# EAGLE design power_control_v12 (EAGLE 9.6.2)
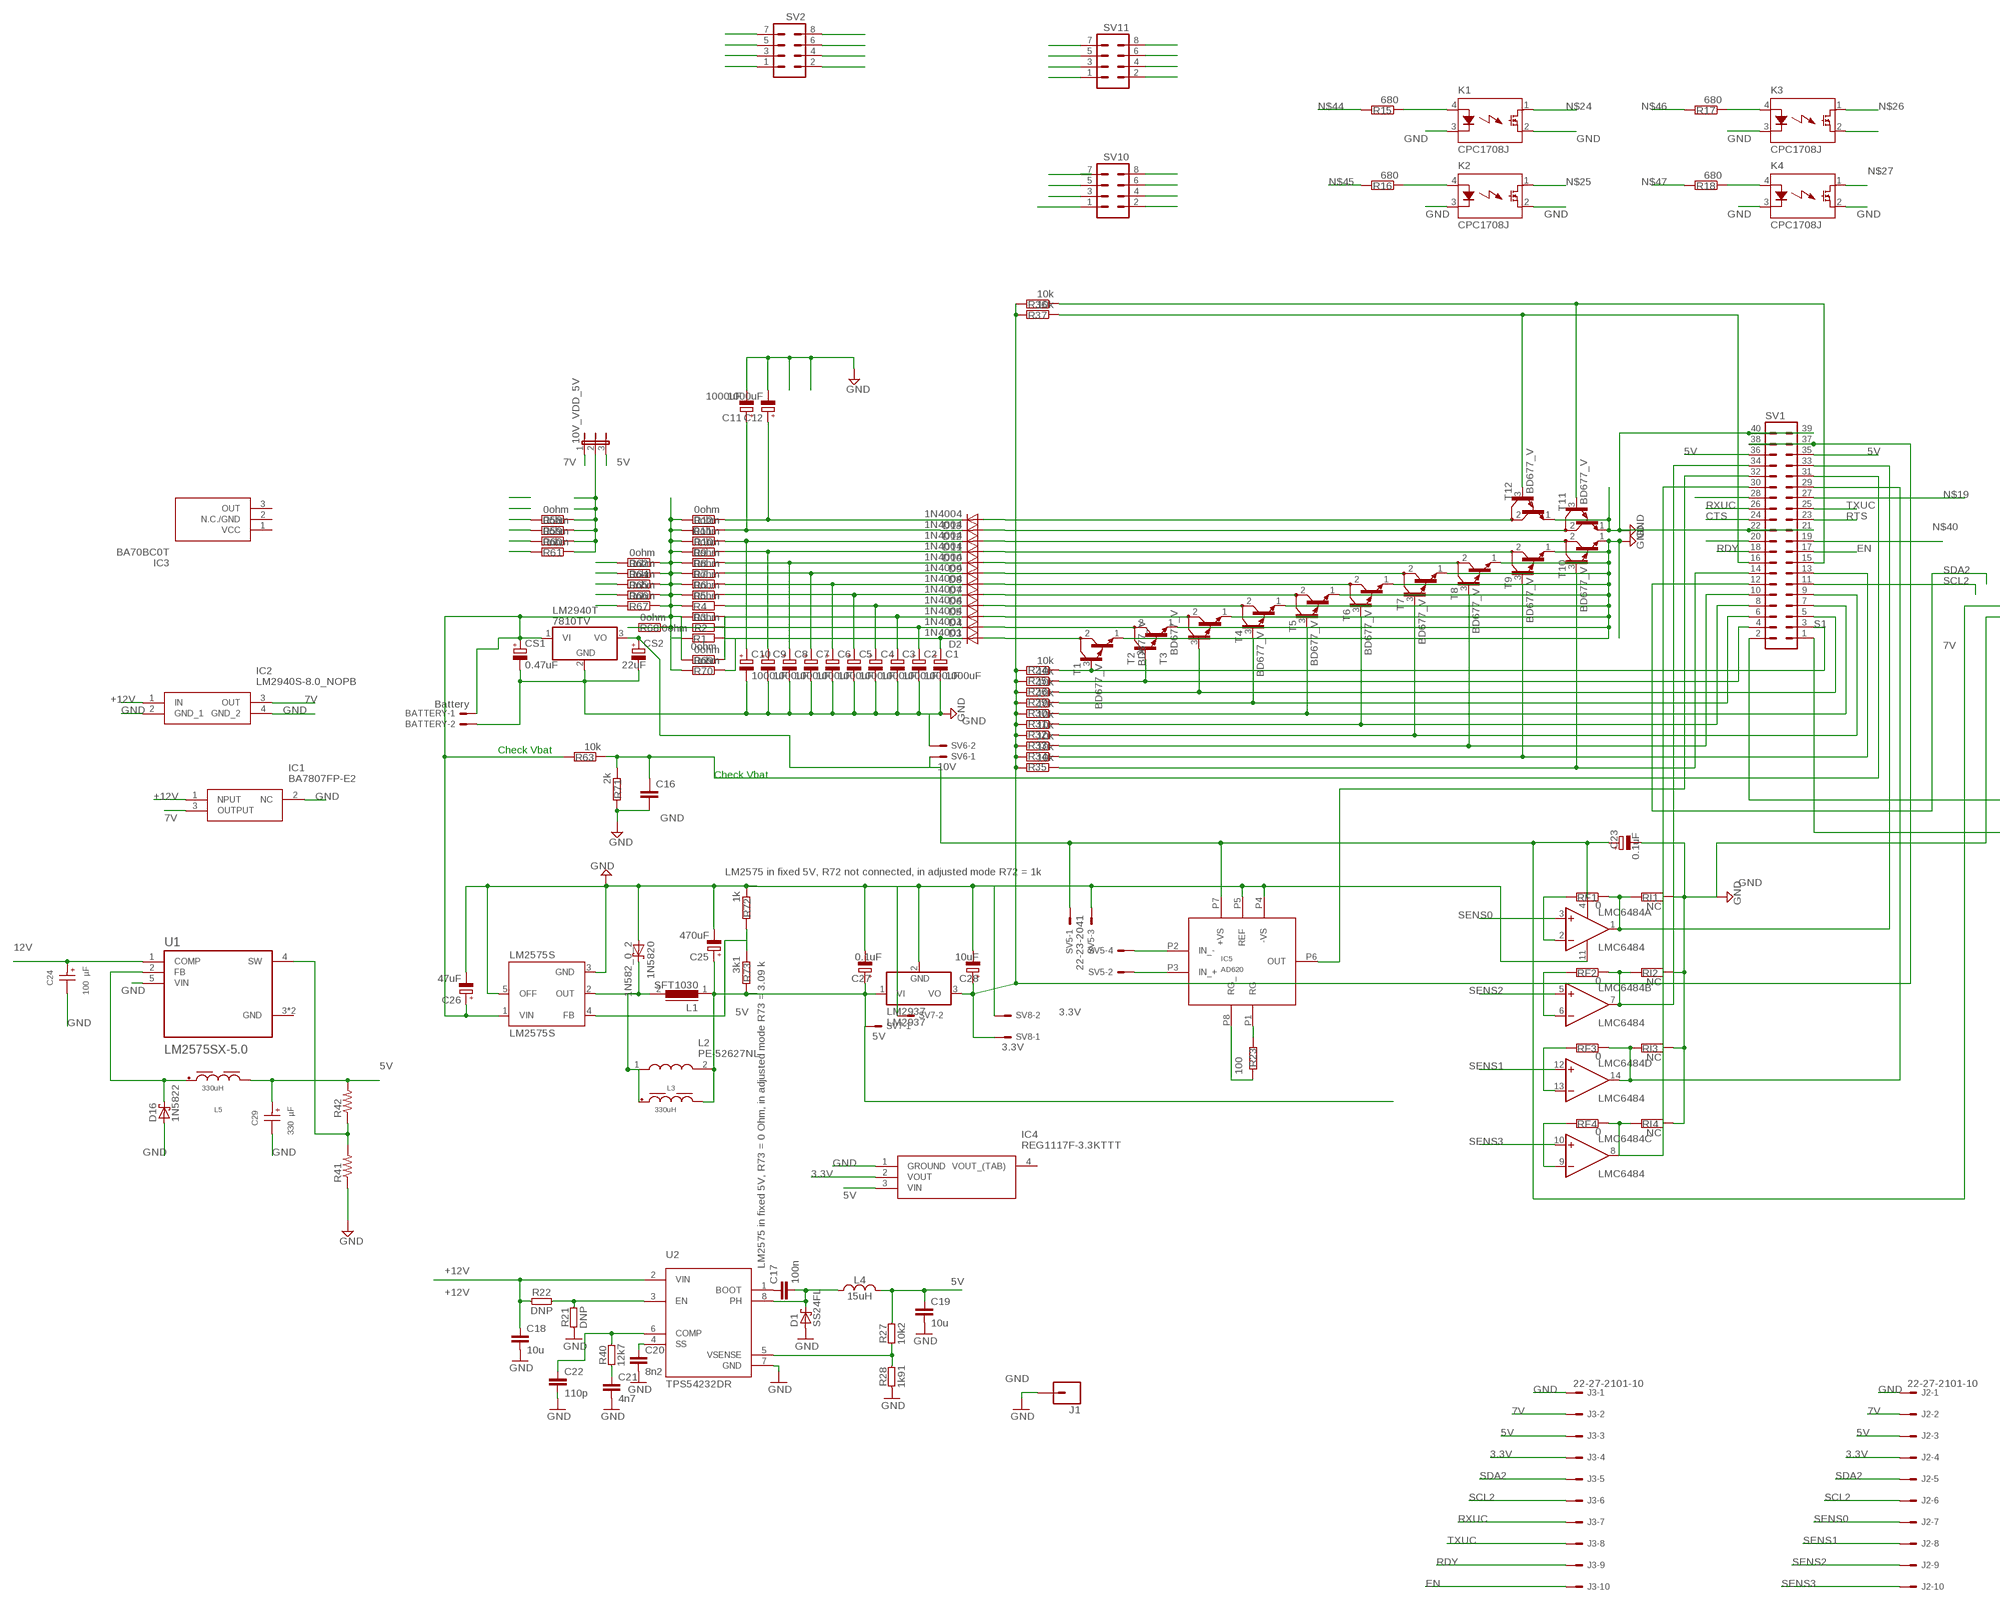
[diagram p0: schematic, sheet 1, part 1 of 2]
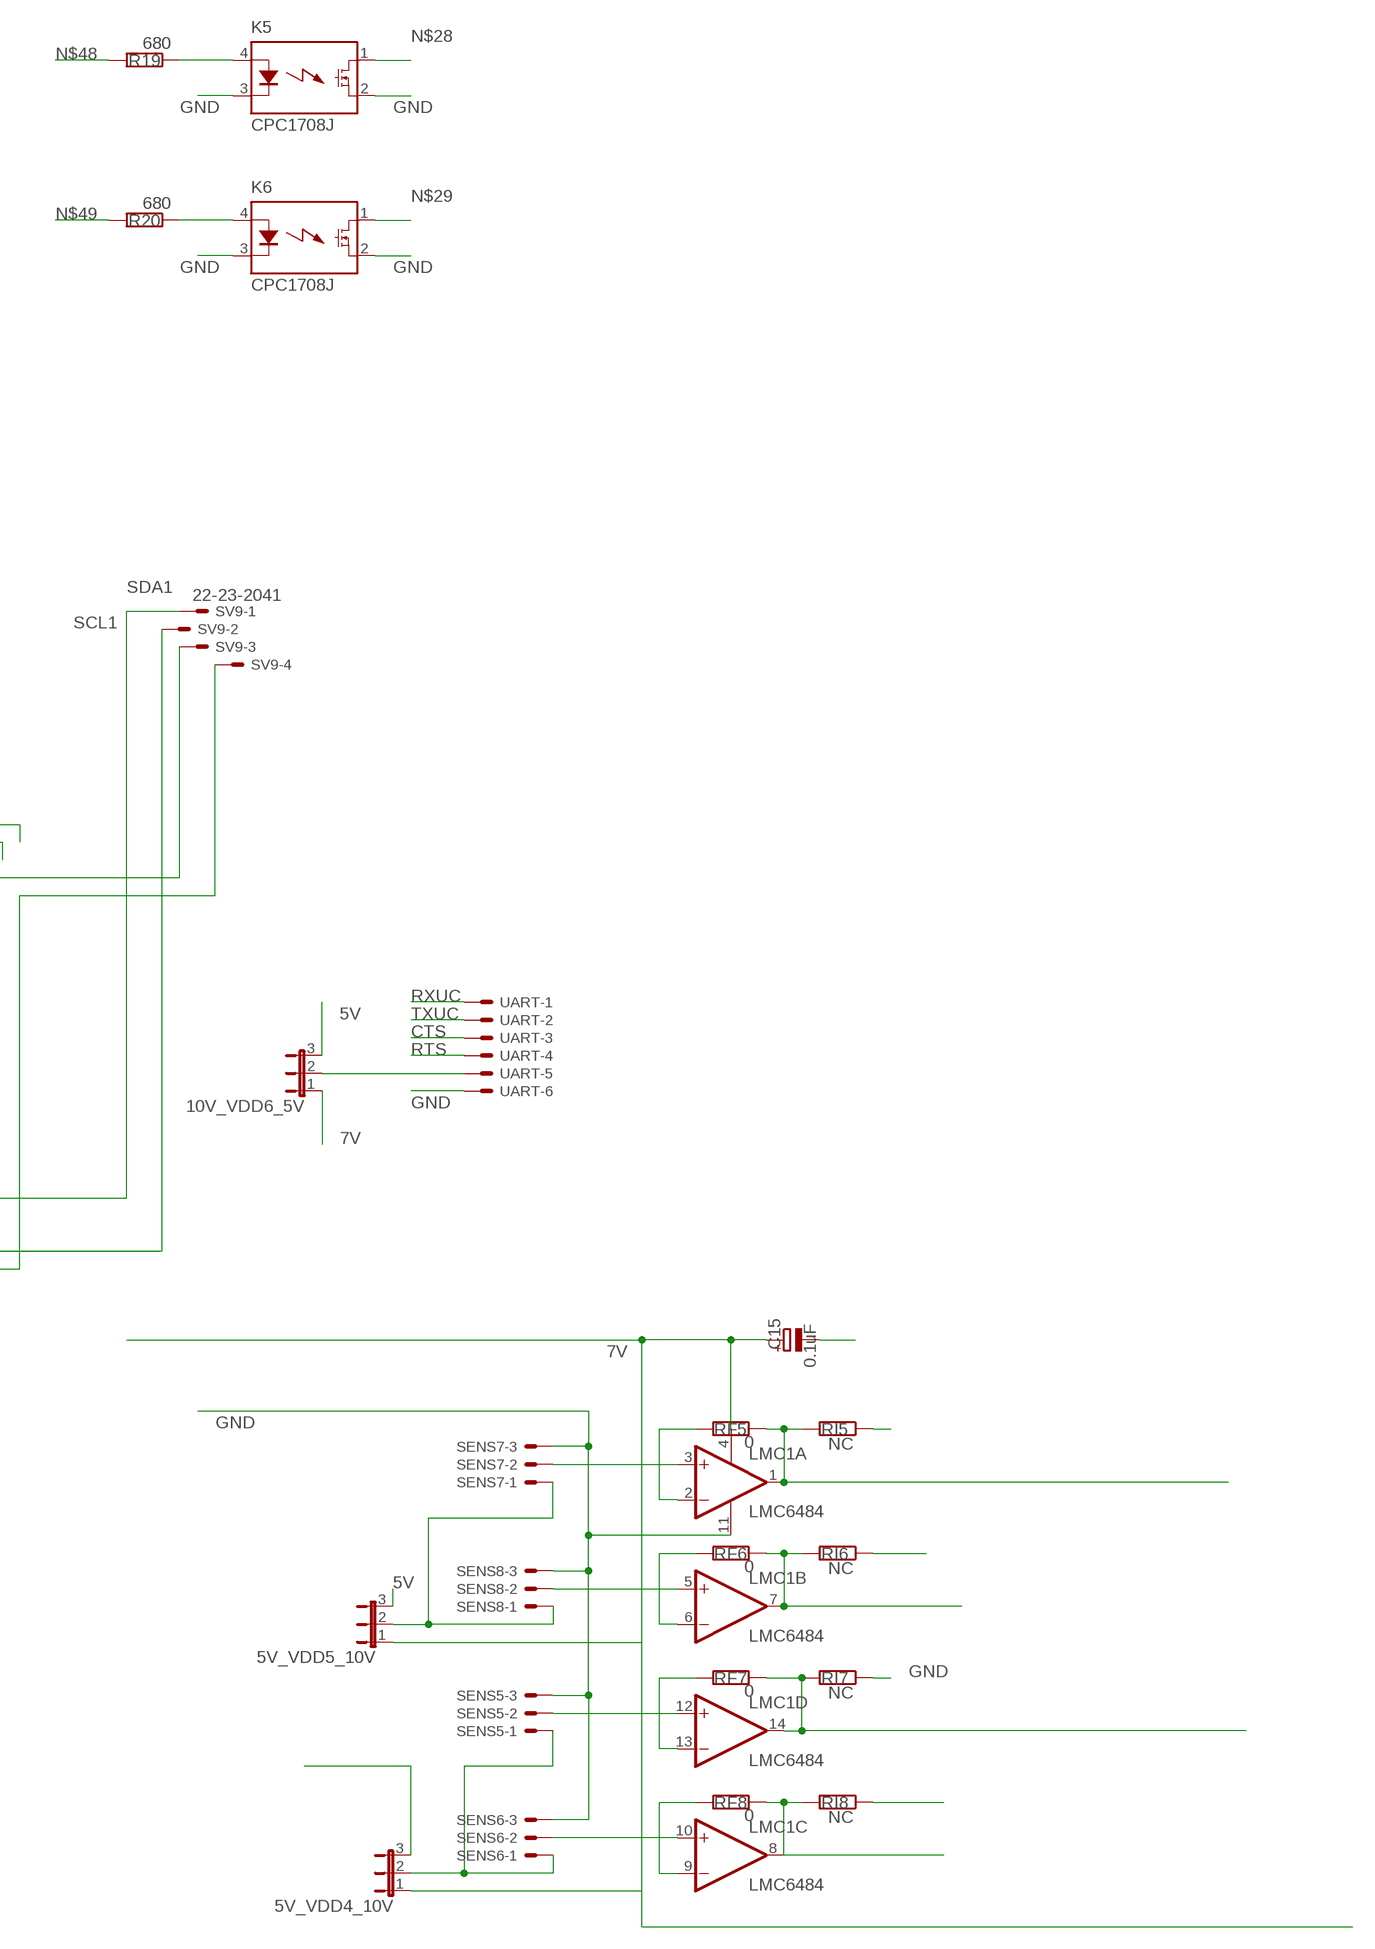
[diagram p1: schematic, sheet 1, part 2 of 2]

## Parts
1N5820  1N582_0_2  SCHOTTKY-DIODEC4111-15  [C4111-15]
5V_VDD4_10V  JP2E  [JP2]
5V_VDD5_10V  JP2E  [JP2]
10V_VDD6_5V  JP2E  [JP2]
10V_VDD_5V  JP2E  [JP2]
BATTERY  Battery  22-23-2021  [22-23-2021]
C1  1000uF  CPOL-EUE5-10.5  [E5-10,5]
C2  1000uF  CPOL-EUE5-10.5  [E5-10,5]
C3  1000uF  CPOL-EUE5-10.5  [E5-10,5]
C4  1000uF  CPOL-EUE5-10.5  [E5-10,5]
C5  1000uF  CPOL-EUE5-10.5  [E5-10,5]
C6  1000uF  CPOL-EUE5-10.5  [E5-10,5]
C7  1000uF  CPOL-EUE5-10.5  [E5-10,5]
C8  1000uF  CPOL-EUE5-10.5  [E5-10,5]
C9  1000uF  CPOL-EUE5-10.5  [E5-10,5]
C10  1000uF  CPOL-EUE5-10.5  [E5-10,5]
C11  1000uF  CPOL-EUE5-10.5  [E5-10,5]
C12  1000uF  CPOL-EUE5-10.5  [E5-10,5]
C15  0.1uF  CPOL-EUE1.8-4  [E1,8-4]
C16  C-EUC0805K  [C0805K]
C17  100n  C-100NF-0402  [0402-1005X55N]
C18  10u  C-10UF-0603  [0603-1608X90N]
C19  10u  C-10UF-0603  [0603-1608X90N]
C20  8n2  C-8N2-0402  [0402-1005X55N]
C21  4n7  C-4N7-0402  [0402-1005X55N]
C22  110p  C-110P-0402  [0402-1005X55N]
C23  0.1uF  CPOL-EUE1.8-4  [E1,8-4]
C24  100 µF  WCAP-AS5H_10X10.5_865230657013  [WCAP-AS5H_10X10.5(DXL)]
C25  470uF  CPOL-EUE3.5-8  [E3,5-8]
C26  47uF  CPOL-EUE2-5  [E2-5]
C27  0.1uF  CPOL-EUE1.8-4  [E1,8-4]
C28  10uF  CPOL-EUE1.8-4  [E1,8-4]
C29  330 µF  WCAP-AS5H_10X10.5_865230357007  [WCAP-AS5H_10X10.5(DXL)]
CS1  0.47uF  CPOL-EUE2-5  [E2-5]
CS2  22uF  CPOL-EUE2-5  [E2-5]
D1  SS24FL  [SOD123F]
D2  1N4001  1N4004  [DO41-10]
D3  1N4001  1N4004  [DO41-10]
D4  1N4004  [DO41-10]
D5  1N4004  [DO41-10]
D6  1N4004  [DO41-10]
D7  1N4004  [DO41-10]
D8  1N4004  [DO41-10]
D9  1N4004  [DO41-10]
D10  1N4004  [DO41-10]
D11  1N4004  [DO41-10]
D12  1N4004  [DO41-10]
D13  1N4004  [DO41-10]
D16  1N5822  SCHOTTKY-DIODEC4111-15  [C4111-15]
IC1  BA7807FP-E2  [BD33KA5FPE2]
IC2  LM2940S-8.0_NOPB  [KTT0003B]
IC3  BA70BC0T  [TO254P480X1010X2300-3P]
IC4  REG1117F-3.3KTTT  [TO254P1524X483-4N]
IC5  AD620  [DIL8]
J1  CONN_01  [1X01]
J2  22-27-2101-10  [6410-10]
J3  22-27-2101-10  [6410-10]
K1  CPC1708J  [I4-PAC]
K2  CPC1708J  [I4-PAC]
K3  CPC1708J  [I4-PAC]
K4  CPC1708J  [I4-PAC]
K5  CPC1708J  [I4-PAC]
K6  CPC1708J  [I4-PAC]
L1  SFT1030  [SFT1030]
L2  PE-52627NL  [PE52629NL]
L3  330uH  WE-PD_1280_744770233  [WE-PD_1280]
L4  15uH  LSRN  [SRN6045]
L5  330uH  WE-PD_1280_744770233  [WE-PD_1280]
LM2575S  LM2575S  [TO263-5]
LM2937  LM2937  [TO263-3]
LM2940T  7810TV  7812TV  [TO220V]
LMC1  LMC6484  OPA4241PA  [DIL14]
LMC6484  LMC6484  OPA4241PA  [DIL14]
R1  0ohm  R-EU_0207/10  [0207/10]
R2  0ohm  R-EU_0207/10  [0207/10]
R3  0ohm  R-EU_0207/10  [0207/10]
R4  0ohm  R-EU_0207/10  [0207/10]
R5  0ohm  R-EU_0207/10  [0207/10]
R6  0ohm  R-EU_0207/10  [0207/10]
R7  0ohm  R-EU_0207/10  [0207/10]
R8  0ohm  R-EU_0207/10  [0207/10]
R9  0ohm  R-EU_0207/10  [0207/10]
R10  0ohm  R-EU_0207/10  [0207/10]
R11  0ohm  R-EU_0207/10  [0207/10]
R12  0ohm  R-EU_0207/10  [0207/10]
R15  680  R-EU_M0805  [M0805]
R16  680  R-EU_M0805  [M0805]
R17  680  R-EU_M0805  [M0805]
R18  680  R-EU_M0805  [M0805]
R19  680  R-EU_M0805  [M0805]
R20  680  R-EU_M0805  [M0805]
R21  DNP  R-DNP-0402  [0402-1005X55N]
R22  DNP  R-DNP-0402  [0402-1005X55N]
R23  100  R-EU_R0805  [R0805]
R24  10k  R-EU_M0805  [M0805]
R25  10k  R-EU_M0805  [M0805]
R26  10k  R-EU_M0805  [M0805]
R27  10k2  R-10K2-0402  [0402-1005X55N]
R28  1k91  R-1K91-0402  [0402-1005X55N]
R29  10k  R-EU_M0805  [M0805]
R30  10k  R-EU_M0805  [M0805]
R31  10k  R-EU_M0805  [M0805]
R32  10k  R-EU_M0805  [M0805]
R33  10k  R-EU_M0805  [M0805]
R34  10k  R-EU_M0805  [M0805]
R35  10k  R-EU_M0805  [M0805]
R36  10k  R-EU_M0805  [M0805]
R37  10k  R-EU_M0805  [M0805]
R40  12k7  R-12K7-0402  [0402-1005X55N]
R41  FLIPFLOP-RES  [0805-THM]
R42  FLIPFLOP-RES  [0805-THM]
R58  0ohm  R-EU_M0805  [M0805]
R59  0ohm  R-EU_M0805  [M0805]
R60  0ohm  R-EU_M0805  [M0805]
R61  0ohm  R-EU_M0805  [M0805]
R62  0ohm  R-EU_M0805  [M0805]
R63  10k  R-EU_M0805  [M0805]
R64  0ohm  R-EU_M0805  [M0805]
R65  0ohm  R-EU_M0805  [M0805]
R66  0ohm  R-EU_M0805  [M0805]
R67  0ohm  R-EU_M0805  [M0805]
R68  0ohm  R-EU_M0805  [M0805]
R69  0ohm  R-EU_M0805  [M0805]
R70  0ohm  R-EU_M0805  [M0805]
R71  2k  R-EU_M0805  [M0805]
R72  1k  R-EU_M0805  [M0805]
R73  3k1  R-EU_M0805  [M0805]
RF1  0  R-EU_M0805  [M0805]
RF2  0  R-EU_R0805  [R0805]
RF3  0  R-EU_M0805  [M0805]
RF4  0  R-EU_M0805  [M0805]
RF5  0  R-EU_M0805  [M0805]
RF6  0  R-EU_R0805  [R0805]
RF7  0  R-EU_M0805  [M0805]
RF8  0  R-EU_M0805  [M0805]
RI1  NC  R-EU_M0805  [M0805]
RI2  NC  R-EU_M0805  [M0805]
RI3  NC  R-EU_M0805  [M0805]
RI4  NC  R-EU_M0805  [M0805]
RI5  NC  R-EU_M0805  [M0805]
RI6  NC  R-EU_M0805  [M0805]
RI7  NC  R-EU_M0805  [M0805]
RI8  NC  R-EU_M0805  [M0805]
SENS5  22-23-2031  [22-23-2031]
SENS6  22-23-2031  [22-23-2031]
SENS7  22-23-2031  [22-23-2031]
SENS8  22-23-2031  [22-23-2031]
SV1  MA20-2  [MA20-2]
SV2  MA04-2  [MA04-2]
SV5  22-23-2041  [22-23-2041]
SV6  10V  22-23-2021  [22-23-2021]
SV7  5V  22-23-2021  [22-23-2021]
SV8  3.3V  22-23-2021  [22-23-2021]
SV9  22-23-2041  [22-23-2041]
SV10  MA04-2  [MA04-2]
SV11  MA04-2  [MA04-2]
T1  BD677_V  [TO126V]
T2  BD677_V  [TO126V]
T3  BD677_V  [TO126V]
T4  BD677_V  [TO126V]
T5  BD677_V  [TO126V]
T6  BD677_V  [TO126V]
T7  BD677_V  [TO126V]
T8  BD677_V  [TO126V]
T9  BD677_V  [TO126V]
T10  BD677_V  [TO126V]
T11  BD677_V  [TO126V]
T12  BD677_V  [TO126V]
U1  LM2575SX-5.0  LM2575SX-5.0/NOPB  [VREG_TPS79625KTTR]
U2  TPS54232DR  TPS54232  [SO08]
UART  22-23-2061  [22-23-2061]

## Nets
3.3V: C28.+ IC4.2(VOUT) J2.4 J3.4 LM2937.3(VO) R24.2 R25.2 R26.2 R29.2 R30.2 R31.2 R32.2 R33.2 R34.2 R35.2 R36.2 R37.2 SV1.37 SV1.38 SV8.1
5V: 5V_VDD4_10V.3 5V_VDD5_10V.3 10V_VDD6_5V.3 10V_VDD_5V.3 C19.1 C25.+ C27.+ C29.1(+) IC4.3(VIN) J2.3 J3.3 L1.1 L2.2 L3.2 L4.2 L5.2 LM2937.1(VI) R27.2 R42.2 R73.2 SV1.35 SV1.36 SV7.1
7V: 5V_VDD4_10V.1 5V_VDD5_10V.1 10V_VDD6_5V.1 10V_VDD_5V.1 C15.+ C23.+ CS2.+ IC1.3(OUTPUT) IC2.3(OUT) IC5.P7(+VS) J2.2 J3.2 LM2940T.3(VO) LMC1.4(P:V+) LMC6484.4(P:V+) SV5.1 SV6.1 SV9.3
12V: C24.1(+) U1.1(COMP)
+12V: BATTERY.1 C18.1 C26.+ CS1.+ IC1.1(NPUT) IC2.1(IN) LM2575S.1(VIN) LM2940T.1(VI) R1.2 R2.2 R3.2 R4.2 R5.2 R6.2 R7.2 R8.2 R9.2 R10.2 R11.2 R12.2 R22.1 R62.1 R63.2 R64.1 R65.1 R66.1 R67.1 R68.1 R69.2 R70.2 U2.2(VIN)
CTS: SV1.24 UART.3
EN: J3.10 SV1.17
GND: 1N5820.A BATTERY.2 C1.- C2.- C3.- C4.- C5.- C6.- C7.- C8.- C9.- C10.- C11.- C12.- C15.- C16.2 C18.2 C19.2 C20.2 C21.2 C22.2 C23.- C24.2(-) C25.- C26.- C27.- C28.- C29.2(-) CS1.- CS2.- D1.A D16.A IC1.2(NC) IC2.2(GND_1) IC2.4(GND_2) IC4.1(GROUND) IC5.P4(-VS) IC5.P5(REF) J1.1 J2.1 J3.1 K1.2(DS2) K1.3(K) K2.2(DS2) K2.3(K) K3.2(DS2) K3.3(K) K4.2(DS2) K4.3(K) K5.2(DS2) K5.3(K) K6.2(DS2) K6.3(K) LM2575S.3(GND) LM2575S.5(OFF) LM2937.2(GND) LM2940T.2(GND) LMC1.11(P:V-) LMC6484.11(P:V-) R21.1 R28.1 R41.1 R71.2 R72.1 RI1.1 RI2.1 RI3.1 RI4.1 RI5.1 RI6.1 RI7.1 RI8.1 SENS5.3 SENS6.3 SENS7.3 SENS8.3 SV1.21 SV1.22 SV1.39 SV1.40 SV5.3 SV6.2 SV7.2 SV8.2 SV9.4 T1.1(E) T2.1(E) T3.1(E) T4.1(E) T5.1(E) T6.1(E) T7.1(E) T8.1(E) T9.1(E) T10.1(E) T11.1(E) T12.1(E) U1.5(VIN) U2.7(GND) UART.6
N$1: C1.+ D2.C R1.1 R70.1 SV2.1
N$2: D2.A SV2.2 T1.2(C)
N$3: C2.+ D3.C R2.1 R68.2 SV2.3
N$4: C3.+ D4.C R3.1 R69.1 SV2.5
N$5: C4.+ D5.C R4.1 R67.2 SV2.7
N$6: C5.+ D6.C R5.1 R66.2 SV10.1
N$7: C6.+ D7.C R6.1 R65.2 SV10.3
N$8: C7.+ D8.C R7.1 R64.2 SV10.5
N$9: C8.+ D9.C R8.1 R62.2 SV10.7
N$10: C9.+ D10.C R9.1 R61.2 SV11.1
N$11: C10.+ D11.C R10.1 R60.2 SV11.3
N$12: C11.+ D12.C R11.1 R59.2 SV11.5
N$13: C12.+ D13.C R12.1 R58.2 SV11.7
N$16: 5V_VDD4_10V.2 SENS5.1 SENS6.1
N$17: LMC1.3(A:+IN) SENS7.2
N$18: LMC1.2(A:-IN) RF5.2
N$19: LMC1.1(A:OUT) RF5.1 RI5.2 SV1.27
N$20: 10V_VDD6_5V.2 UART.5
N$21: LMC1.5(B:+IN) SENS8.2
N$22: LM2575S.4(FB) R72.2 R73.1
N$23: R36.1 SV1.15 T11.3(B)
N$24: D3.A K1.1(DS1) SV2.4 T2.2(C)
N$25: D4.A K2.1(DS1) SV2.6 T3.2(C)
N$26: D5.A K3.1(DS1) SV2.8 T4.2(C)
N$27: D6.A K4.1(DS1) SV10.2 T5.2(C)
N$28: D7.A K5.1(DS1) SV10.4 T6.2(C)
N$29: D8.A K6.1(DS1) SV10.6 T7.2(C)
N$30: D9.A SV10.8 T8.2(C)
N$31: D10.A SV11.2 T9.2(C)
N$32: D11.A SV11.4 T10.2(C)
N$33: D12.A SV11.6 T11.2(C)
N$34: D13.A SV11.8 T12.2(C)
N$35: LMC1.6(B:-IN) RF6.2
N$36: LMC1.7(B:OUT) RF6.1 RI6.2 SV1.28
N$37: LMC1.13(D:-IN) RF7.2
N$38: LMC1.9(C:-IN) RF8.2
N$39: LMC1.12(D:+IN) SENS5.2
N$40: LMC1.14(D:OUT) RF7.1 RI7.2 SV1.19
N$44: R15.2 R25.1 SV1.4 T2.3(B)
N$45: R16.2 R26.1 SV1.5 T3.3(B)
N$46: R17.2 R29.1 SV1.6 T4.3(B)
N$47: R18.2 R30.1 SV1.7 T5.3(B)
N$48: R19.2 R31.1 SV1.8 T6.3(B)
N$49: R20.2 R32.1 SV1.9 T7.3(B)
N$50: R33.1 SV1.10 T8.3(B)
N$51: R34.1 SV1.13 T9.3(B)
N$52: R35.1 SV1.14 T10.3(B)
N$53: LMC1.10(C:+IN) SENS6.2
N$54: LMC1.8(C:OUT) RF8.1 RI8.2 SV1.20
N$55: K1.4(A) R15.1
N$56: K2.4(A) R16.1
N$57: 5V_VDD5_10V.2 SENS7.1 SENS8.1
N$58: K3.4(A) R17.1
N$61: R37.1 SV1.16 T12.3(B)
N$63: K5.4(A) R19.1
N$64: R21.2 R22.2 U2.3(EN)
N$65: IC5.P2(IN_-) SV5.4
N$66: IC5.P3(IN_+) SV5.2
N$67: 1N5820.C L1.2 L2.1 L3.1 LM2575S.2(OUT)
N$68: LMC6484.8(C:OUT) RF4.1 RI4.2 SV1.30
N$69: K6.4(A) R20.1
N$70: K4.4(A) R18.1
N$71: IC5.P1(RG) R23.2
N$72: C17.1 U2.1(BOOT)
N$73: C17.2 D1.C L4.1 U2.8(PH)
N$74: IC5.P8(RG_) R23.1
N$75: IC5.P6(OUT) SV1.32
N$76: R27.1 R28.2 U2.5(VSENSE)
N$77: C20.1 U2.4(SS)
N$79: LMC6484.2(A:-IN) RF1.2
N$80: 10V_VDD_5V.2 R58.1 R59.1 R60.1 R61.1
N$81: LMC6484.1(A:OUT) RF1.1 RI1.2 SV1.33
N$82: C16.1 R63.1 R71.1 SV1.31
N$84: LMC6484.6(B:-IN) RF2.2
N$85: LMC6484.7(B:OUT) RF2.1 RI2.2 SV1.34
N$87: LMC6484.13(D:-IN) RF3.2
N$88: C22.1 R40.2 U2.6(COMP)
N$89: LMC6484.14(D:OUT) RF3.1 RI3.2 SV1.29
N$90: LMC6484.9(C:-IN) RF4.2
N$91: C21.1 R40.1
N$93: D16.C L5.1 U1.2(FB)
N$94: R41.2 R42.1 U1.4(SW)
RDY: J3.9 SV1.18
RTS: SV1.23 UART.4
RXUC: J3.7 SV1.26 UART.1
S1: R24.1 SV1.3 T1.3(B)
SCL1: SV1.1 SV9.2
SCL2: J2.6 J3.6 SV1.11
SDA1: SV1.2 SV9.1
SDA2: J2.5 J3.5 SV1.12
SENS0: J2.7 LMC6484.3(A:+IN)
SENS1: J2.8 LMC6484.12(D:+IN)
SENS2: J2.9 LMC6484.5(B:+IN)
SENS3: J2.10 LMC6484.10(C:+IN)
TXUC: J3.8 SV1.25 UART.2
Unconnected: IC3.1(VCC) IC3.2(N.C./GND) IC3.3(OUT) IC4.4(VOUT_(TAB))

## Notes on the sheet
- Check Vbat
- Check Vbat
- LM2575 in fixed 5V, R72 not connected, in adjusted mode R72 = 1k
- LM2575 in fixed 5V, R73 = 0 Ohm, in adjusted mode R73 = 3.09 k

## Power pins joined to a net without a drawn wire
GND: U1.3(GND) U1.6(GND)

## Library data of the parts
1N5820 = diode:SCHOTTKY-DIODE: Schottky Diode
5V_VDD4_10V 5V_VDD5_10V 10V_VDD6_5V 10V_VDD_5V = jumper:JP2E: JUMPER
BATTERY SV6-SV8 = con-molex:22-23-2021: .100" (2.54mm) Center Header - 2 Pin; MF: MOLEX; MPN: 22-23-2021; OC_FARNELL: 1462926; OC_NEWARK: 25C3832
C1-C12 C15 C23 C25-C28 CS1 CS2 = rcl:CPOL-EU: POLARIZED CAPACITOR, European symbol
C16 = rcl:C-EU: CAPACITOR, European symbol; SPICEPREFIX: C
C17 = Arduino-rcl:C: SMD Capacitor; CODE-ARDUINO: 0132; DATASHEET: http://www.tdk.com/pdf/TDKMLCCCapRange.pdf; DISTRIBUTOR-LINK: http://www.digikey.com/product-detail/en/tdk-corporation/C1005X5R1H104K050BB/445-5942-1-ND/2443982; DISTRIBUTOR-PN: 445-5942-1-ND; MANUFACTURER: TDK; MANUFACTURER-PN: C1005X5R1H104K050BB
C18 C19 = Arduino-rcl:C: SMD Capacitor; CODE-ARDUINO: 2213; DATASHEET: http://www.murata.com/~/media/webrenewal/support/library/catalog/products/capacitor/mlcc/c02e.pdf; DISTRIBUTOR-LINK: http://www.digikey.com/product-search/en?keywords=490-10728-1-ND; DISTRIBUTOR-PN: 490-10728-1-ND; MANUFACTURER: Murata; MANUFACTURER-PN: GRM188R61C106KAALD
C20 = Arduino-rcl:C: SMD Capacitor; CODE-ARDUINO: 2263; DATASHEET: http://www.yageo.com/documents/recent/UPY-GPHC_X7R_6.3V-to-50V_18.pdf; DISTRIBUTOR-LINK: https://www.digikey.com/product-detail/en/yageo/CC0402KRX7R7BB822/311-1041-1-ND/302958; DISTRIBUTOR-PN: 311-1041-1-ND; MANUFACTURER: Yageo; MANUFACTURER-PN: CC0402KRX7R7BB822
C21 = Arduino-rcl:C: SMD Capacitor; CODE-ARDUINO: 2266; DATASHEET: http://search.murata.co.jp/Ceramy/image/img/A01X/partnumbering_e_01.pdf; DISTRIBUTOR-LINK: https://www.digikey.com/product-detail/en/murata-electronics-north-america/GRM155R71H472KA01J/490-8259-1-ND/4380553; DISTRIBUTOR-PN: 490-8259-1-ND; MANUFACTURER: Murata; MANUFACTURER-PN: GRM155R71H472KA01J
C22 = Arduino-rcl:C: SMD Capacitor; CODE-ARDUINO: 2264; DATASHEET: http://search.murata.co.jp/Ceramy/image/img/A01X/G101/ENG/GRM1555C1H111GA01-01.pdf; DISTRIBUTOR-LINK: https://www.digikey.com/product-detail/en/murata-electronics-north-america/GRM1555C1H111GA01D/490-6195-1-ND/3845392; DISTRIBUTOR-PN: 490-6195-1-ND; MANUFACTURER: Murata; MANUFACTURER-PN: GRM1555C1H111GA01D
C24 = 865230657013_Eagle_WCAP-AS5H_rev20a:WCAP-AS5H_10X10.5: WCAP-AS5H Aluminium Electrolytic Capacitors Long Life +105 °C Characteristics Long life product series Mounting style: V-Chip SMT Capacitance range: 0.1 µF ‒ 1000 µF Capacitance tolerance: ±20 % Voltage range (UR): 6.3 ‒ 50 V(DC) Operating temperature: -40 °C up to +105 °C Endurance: 5000 h @ +105 °C Dimensions (DxL) in mm: 4.0 x 5.5 up to 10.0 x 10.5 Recommended soldering: Reflow soldering Applications Long life applications (industry, medical) Input and output capacitor for switched-mode power supply Filtering Smoothing e.g. DC/DC converter, AC/DC converter, satellite receiver, control panel <https://www.we-online.com/catalog/media/o55801v209%20Family_WCAP-AS5H.jpg> Details see: https://www.we-online.com/catalog/en/WCAP-AS5H/ Updated by yingchun,Shan;2020-03-04 2020(C) Würth Elektronik; DATASHEET-URL: https://www.we-online.com/catalog/datasheet/865230657013.pdf; DF: 12%; DIAMETER: 10mm; I-LEAK: 50uA; I-RIPPLE: 160mA; L: 10.5mm; OPERATING-TEMPERATURE: -40 °C up to +105 °C; PART-NUMBER: 865230657013; TECHNICAL-REFERENCE: ASDF105101M050DVCTEE000; VR: 50V(DC); Z: 
C29 = 865230657013_Eagle_WCAP-AS5H_rev20a:WCAP-AS5H_10X10.5: WCAP-AS5H Aluminium Electrolytic Capacitors Long Life +105 °C Characteristics Long life product series Mounting style: V-Chip SMT Capacitance range: 0.1 µF ‒ 1000 µF Capacitance tolerance: ±20 % Voltage range (UR): 6.3 ‒ 50 V(DC) Operating temperature: -40 °C up to +105 °C Endurance: 5000 h @ +105 °C Dimensions (DxL) in mm: 4.0 x 5.5 up to 10.0 x 10.5 Recommended soldering: Reflow soldering Applications Long life applications (industry, medical) Input and output capacitor for switched-mode power supply Filtering Smoothing e.g. DC/DC converter, AC/DC converter, satellite receiver, control panel <https://www.we-online.com/catalog/media/o55801v209%20Family_WCAP-AS5H.jpg> Details see: https://www.we-online.com/catalog/en/WCAP-AS5H/ Updated by yingchun,Shan;2020-03-04 2020(C) Würth Elektronik; DATASHEET-URL: https://www.we-online.com/catalog/datasheet/865230357007.pdf; DF: 22%; DIAMETER: 10mm; I-LEAK: 52.8uA; I-RIPPLE: 300mA; L: 10.5mm; OPERATING-TEMPERATURE: -40 °C up to +105 °C; PART-NUMBER: 865230357007; TECHNICAL-REFERENCE: ASDF105331M016DVCTEE000; VR: 16V(DC); Z: 
D1 = Arduino-diodes:SS24FL: Schotky diode; CODE-ARDUINO: 2262; DATASHEET: https://www.fairchildsemi.com/datasheets/SS/SS24FL.pdf; DISTRIBUTOR-LINK: https://www.digikey.com/product-detail/en/fairchild-on-semiconductor/SS24FL/SS24FLCT-ND/5305093; DISTRIBUTOR-PN: SS24FLCT-ND; MANUFACTURER: Fairchild; MANUFACTURER-PN: SS24FL
D2-D13 = diode:1N4004: DIODE general purpose rectifier, 1 A
D16 = adafruit:SCHOTTKY-DIODE: Schottky Diode
IC1 = SamacSys_Parts:BA7807FP-E2: Voltage Regulator 1A 7V TO252-3 Source: Datasheet <https://datasheet.datasheetarchive.com/originals/distributors/Datasheets_SAMA/714122c45940060be2b498e3fb5d88fa.pdf>; DESCRIPTION: Voltage Regulator 1A 7V TO252-3; HEIGHT: 2mm; MANUFACTURER_NAME: ROHM Semiconductor; MANUFACTURER_PART_NUMBER: BA7807FP-E2; MOUSER_PART_NUMBER: 755-BA7807FP-E2; MOUSER_PRICE-STOCK: https://www.mouser.co.uk/ProductDetail/ROHM-Semiconductor/BA7807FP-E2?qs=5JXiti3P7mzHa4ZFTCbkow%3D%3D
IC2 = SamacSys_Parts:LM2940S-8.0_NOPB: Texas Instruments LM2940S-8.0/NOPB, LDO Voltage Regulator, 1A, 8 V, 0 26 Vin, 3-Pin D2PAK Source: Datasheet <http://www.ti.com/lit/gpn/LM2940-N>; ARROW_PART_NUMBER: LM2940S-8.0/NOPB; ARROW_PRICE-STOCK: https://www.arrow.com/en/products/lm2940s-8.0nopb/texas-instruments?region=nac; DESCRIPTION: Texas Instruments LM2940S-8.0/NOPB, LDO Voltage Regulator, 1A, 8 V, 0 26 Vin, 3-Pin D2PAK; HEIGHT: mm; MANUFACTURER_NAME: Texas Instruments; MANUFACTURER_PART_NUMBER: LM2940S-8.0/NOPB; MOUSER_PART_NUMBER: 926-LM2940S-80/NOPB; MOUSER_PRICE-STOCK: https://www.mouser.co.uk/ProductDetail/Texas-Instruments/LM2940S-80-NOPB?qs=X1J7HmVL2ZGw2ZW1l4f2LA%3D%3D
IC3 = SamacSys_Parts:BA70BC0T: LDO Voltage Regulators REG 1A 7V Source: Datasheet <https://componentsearchengine.com/Datasheets/1/BA70BC0T.pdf>; DESCRIPTION: LDO Voltage Regulators REG 1A 7V; HEIGHT: 4.8mm; MANUFACTURER_NAME: ROHM Semiconductor; MANUFACTURER_PART_NUMBER: BA70BC0T; MOUSER_PART_NUMBER: 755-BA70BC0T; MOUSER_PRICE-STOCK: https://www.mouser.co.uk/ProductDetail/ROHM-Semiconductor/BA70BC0T?qs=4kLU8WoGk0tjEldopnWAZg%3D%3D
IC4 = SamacSys_Parts:REG1117F-3.3KTTT: Reg LDO Lin Fix Pos 3.3V 0.8A D2PAK Source: Datasheet <http://www.ti.com/lit/ds/symlink/reg1117a.pdf>; ARROW_PART_NUMBER: REG1117F-3.3KTTT; ARROW_PRICE-STOCK: https://www.arrow.com/en/products/reg1117f-3.3kttt/texas-instruments?region=europe; DESCRIPTION: Reg LDO Lin Fix Pos 3.3V 0.8A D2PAK; HEIGHT: 4.83mm; MANUFACTURER_NAME: Texas Instruments; MANUFACTURER_PART_NUMBER: REG1117F-3.3KTTT; MOUSER_PART_NUMBER: 595-REG1117F-3.3KTTT; MOUSER_PRICE-STOCK: https://www.mouser.com/Search/Refine.aspx?Keyword=595-REG1117F-3.3KTTT
IC5 = ad620:AD620
J1 = SparkFun-Connectors:CONN_01: Single connection point. Often used as Generic Header-pin footprint for 0.1 inch spaced/style header connections On any of the 0.1 inch spaced packages, you can populate with these: Break Away Headers - Straight <https://www.sparkfun.com/products/116> (PRT-00116) Break Away Male Headers - Right Angle <https://www.sparkfun.com/products/553> (PRT-00553) Female Headers <https://www.sparkfun.com/products/115> (PRT-00115) Break Away Headers - Machine Pin <https://www.sparkfun.com/products/117> (PRT-00117) Break Away Female Headers - Swiss Machine Pin <https://www.sparkfun.com/products/743> (PRT-00743) This device is also useful as a general connection point to wire up your design to another part of your project. Our various solder wires solder well into these plated through hole pads. Hook-Up Wire - Assortment (Stranded, 22 AWG) <https://www.sparkfun.com/products/11375> (PRT-11375) Hook-Up Wire - Assortment (Solid Core, 22 AWG) <https://www.sparkfun.com/products/11367> (PRT-11367) View the entire wire category on our website here <https://www.sparkfun.com/categories/141> Special notes: SMTSO-256-ET is a "flush mount" nut for a 4-40 screw. We mostly use this on specialty testbeds; it is a nice way to connect hardware to your PCB at an adjustable hieght. Also note, the SNAP packages are for using a snappable style connector. We sell a baggie of snaps and they are also used on two LilyPad designs: Snap Assortment - 30 pack (male and female) <https://www.sparkfun.com/products/11347> (DEV-11347) LilyPad Arduino SimpleSnap <https://www.sparkfun.com/products/10941> (DEV-10941) LilyPad SimpleSnap Protoboard <https://www.sparkfun.com/products/10940> (DEV-10940)
J2 J3 = con-molex:22-?-10: CONNECTOR wire to board 2.54 mm (.1 inch) pitch header; MF: MOLEX; OC_FARNELL: unknown; OC_NEWARK: unknown
K1-K6 = relay:CPC1708J: Single-Pole, Normally Open i4-PAC (TM) DC Power Relay Source: Data sheet <http://www.clare.com/home/pdfs.nsf/www/CPC1708.pdf/$file/CPC1708.pdf>
L1 = inductors:SFT1030: INDUCTOR
L2 = PE52627NL:PE-52627NL: Pulse 330 uH +/-20% Leaded Inductor, 1A Idc, 780m Rdc Source: Datasheet <https://componentsearchengine.com/Datasheets/1/PE-52627NL.pdf>; DESCRIPTION: Pulse 330 uH +/-20% Leaded Inductor, 1A Idc, 780m Rdc; HEIGHT: mm; MANUFACTURER_NAME: Pulse; MANUFACTURER_PART_NUMBER: PE-52627NL; MOUSER_PART_NUMBER: 673-PE-52627NL; MOUSER_PRICE-STOCK: https://www.mouser.com/Search/Refine.aspx?Keyword=673-PE-52627NL
L3 L5 = 744770233_Eagle_WE-PD_rev20a:WE-PD_1280: WE-PD SMT Power Inductor Characteristics AECQ 200 Qualified Ultra low RDC and RAC Highest possible saturation current based on Ferrite Suitable for switching frequency up to 10MHz Temperature dependent parameter available on Redexpert Operating Temperature from -40°C to +125°C / +150°C Types WE-PD: Since always with low loss material, tight tolerances and high saturation behavior compared to other manufacturers in the market WE-PD Robust: Plastic base improves the mechanical stability and efficiency WE-PD Performance: MnZn core improves Saturation and RDC for highest efficiency Applications Switch Mode Power supplies from 0,1W up to 300W Integrated DC DC Converter Ideal for Switch Mode Power supplies with extreme high efficiency (>95%) <https://www.we-online.com/catalog/media/o14825v209%20Family_WE-PD.jpg> Details see: https://www.we-online.com/catalog/en/WE-PD/ Updated by Yingchun,Shan 2019-07-25 2019 (C) Wurth Elektronik; DATASHEET-URL: https://www.we-online.com/catalog/datasheet/744770233.pdf; FRES: 3MHz; IR: 1.1A; ISAT: 1.1A; MOUNT: SMT; PART-NUMBER: 744770233; RDC-MAX: 640mOhm; RDC-TYP: 349mOhm; VERSION: Standard
L4 = Arduino-rcl:L: Inductors; CODE-ARDUINO: 2261; DATASHEET: http://pdf1.alldatasheet.com/datasheet-pdf/view/442254/BOURNS/SRN6045-150M.html; DISTRIBUTOR-LINK: https://www.digikey.com/product-detail/en/bourns-inc/SRN6045-150M/SRN6045-150MCT-ND/2756165; DISTRIBUTOR-PN: SRN6045-150M; MANUFACTURER: Bourns; MANUFACTURER-PN: SRN6045-150M
LM2575S = v-reg-3:LM2575: National Semiconductor <http://www.national.com> 1.0A "Simple Switcher"(c) 52kHz, Vout 1.23-37V (HV: 57V), Vin 40V (HV: 60V), 50µA standby current
LM2937 = linear:LM2937: LM2937-2.5, LM2937-3.3 400mA and 500mA Voltage Regulators Source: http://cache.national.com/ds/LM/LM2937-2.5.pdf
LM2940T = linear:78*: Positive VOLTAGE REGULATOR Source: http://cache.national.com/ds/LM/LM78L05.pdf http://www.fairchildsemi.com/ds/LM/LM7805.pdf
LMC1 LMC6484 = linear:OPA4*: Quad Operational Amplifier Low Power, Single-Supply, Rail-To-Rail Operational Amplifier Source: http://focus.ti.com/lit/ds/symlink/opa2345.pdf http://focus.ti.com .. opa241.pdf
R1-R12 R15-R20 R23-R26 R29-R37 R58-R73 RF1-RF8 RI1-RI8 = rcl:R-EU_: RESISTOR, European symbol
R21 R22 = Arduino-rcl:R: SMD Resistor; CODE-ARDUINO: DNP; DATASHEET: DNP; DISTRIBUTOR-LINK: DNP; DISTRIBUTOR-PN: DNP; MANUFACTURER: DNP; MANUFACTURER-PN: DNP
R27 = Arduino-rcl:R: SMD Resistor; CODE-ARDUINO: 2265; DATASHEET: www.yageo.com.tw/exep/pages/download/literatures/PYu-R_INT-thick_7.pdf; DISTRIBUTOR-LINK: https://www.digikey.com/product-detail/en/yageo/RT0402DRD0710K2L/311-2129-1-ND/6128548; DISTRIBUTOR-PN: 311-2129-1-ND; MANUFACTURER: Yageo; MANUFACTURER-PN: RT0402DRD0710K2L
R28 = Arduino-rcl:R: SMD Resistor; CODE-ARDUINO: 2267; DATASHEET: www.yageo.com.tw/exep/pages/download/literatures/PYu-R_INT-thick_7.pdf; DISTRIBUTOR-LINK: https://www.digikey.com/product-detail/en/yageo/RC0402FR-071K91L/YAG3049CT-ND/5281914; DISTRIBUTOR-PN: YAG3049CT-ND; MANUFACTURER: Yageo; MANUFACTURER-PN: RC0402FR-071K91L
R40 = Arduino-rcl:R: SMD Resistor; CODE-ARDUINO: 2260; DATASHEET: www.yageo.com.tw/exep/pages/download/literatures/PYu-R_INT-thick_7.pdf; DISTRIBUTOR-LINK: https://www.digikey.com/product-detail/en/yageo/RC0402FR-0712K7L/YAG2964CT-ND/5281829; DISTRIBUTOR-PN: YAG2964CT-ND; MANUFACTURER: Yageo; MANUFACTURER-PN: RC0402FR-0712K7L
R41 R42 = adafruit:FLIPFLOP-RES: Flip Flop resistor An 0805 resistor inside a standard 1/4W 5% resistor. Makes for easy mods
SENS5-SENS8 = con-molex:22-23-2031: .100" (2.54mm) Center Header - 3 Pin; MF: MOLEX; MPN: 22-23-2031; OC_FARNELL: 1462950; OC_NEWARK: 30C0862
SV1 = con-lstb:MA20-2: PIN HEADER
SV2 SV10 SV11 = con-lstb:MA04-2: PIN HEADER; OC_FARNELL: unknown; OC_NEWARK: unknown
SV5 SV9 = con-molex:22-23-2041: .100" (2.54mm) Center Header - 4 Pin; MF: MOLEX; MPN: 22-23-2041; OC_FARNELL: 1462920; OC_NEWARK: 38C0355
T1-T12 = transistor-npn:BD677*: NPN Darlington Transistor
U1 = LM2575SX-5.0_NOPB:LM2575SX-5.0/NOPB; DESCRIPTION: SIMPLE SWITCHER 1A Step-Down Voltage Regulator 5-DDPAK/TO-263 -40 to 125; DIGI-KEY_PART_NUMBER: LM2575SX-5.0/NOPBCT-ND; MF: Texas Instruments; MP: LM2575SX-5.0/NOPB; PACKAGE: TO-263-5 Texas Instruments; PURCHASE-URL: https://pricing.snapeda.com/search/part/LM2575SX-5.0/NOPB/?ref=eda
U2 = Arduino-ICs:TPS54232: Buck converter IC; CODE-ARDUINO: 2269; DATASHEET: http://www.ti.com/lit/ds/symlink/tps54232.pdf; DISTRIBUTOR-LINK: https://www.digikey.com/product-detail/en/texas-instruments/TPS54232DR/296-39414-1-ND/5143365; DISTRIBUTOR-PN: 296-39414-1-ND; MANUFACTURER: Texas Instruments; MANUFACTURER-PN: TPS54232DR
UART = con-molex:22-23-2061: .100" (2.54mm) Center Header - 6 Pin; MF: MOLEX; MPN: 22-23-2061; OC_FARNELL: 1462922; OC_NEWARK: 27C1933

## Net classes
1 supply: width 0.584 mm, clearance 0.508 mm

## Board
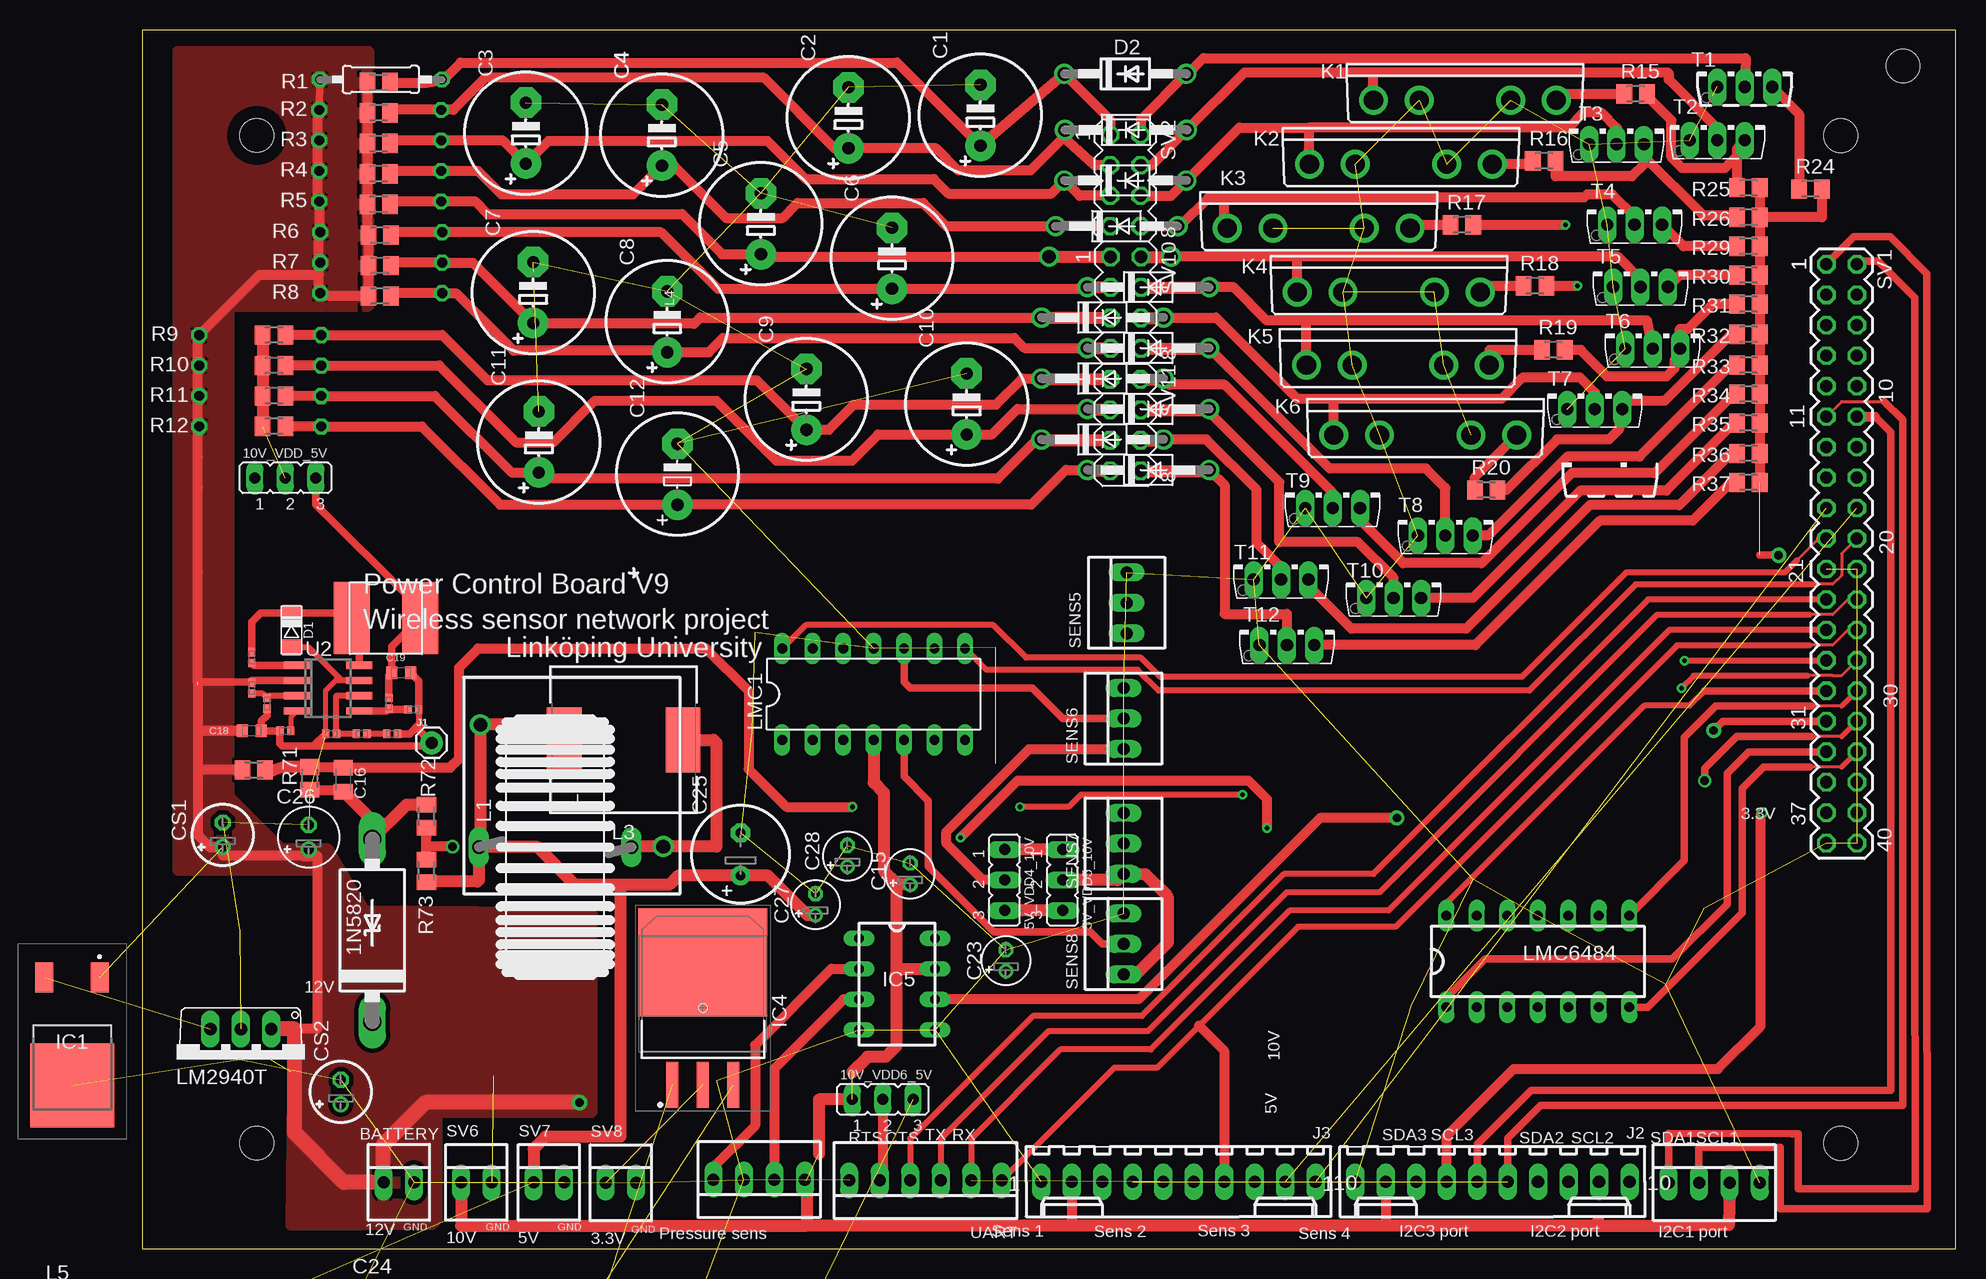
[diagram p2: board, top side]
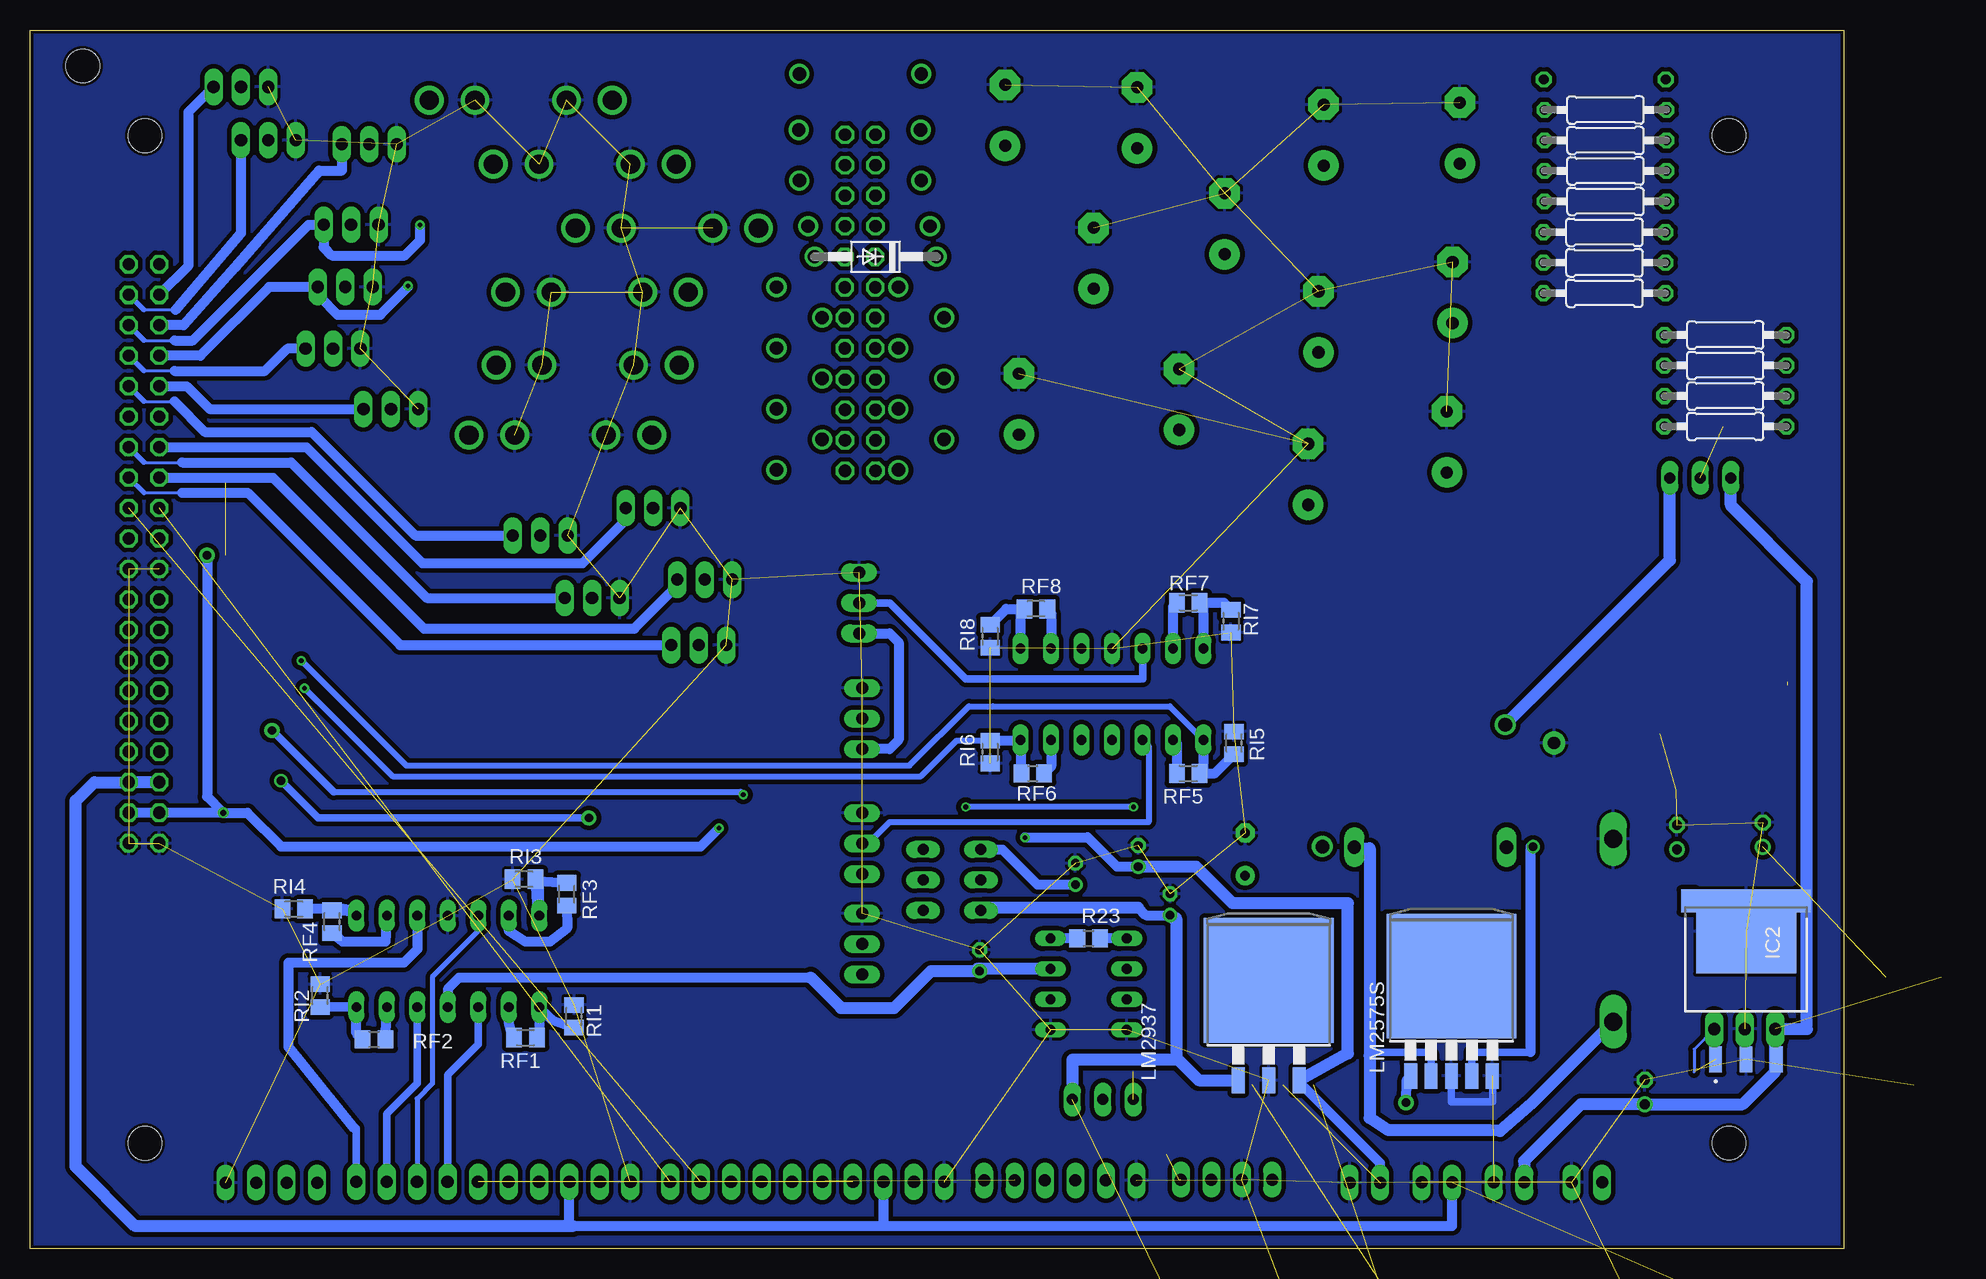
[diagram p3: board, bottom side, seen from below]

Size 151.13 x 101.6 mm. Coordinates in mm from the lower left corner, seen from the top.
Outline: 151.13,101.6 0,101.6 0,0 151.13,0 151.13,101.6
Copper layers (1*16): Top 0.035mm / dielectric 1.5mm / Bottom 0.035mm
Design rules "10mil *": minimum track width 10mil, minimum drill 15mil, track to track 15mil, track to pad 15mil, pad to pad 10mil, via to via 10mil, smd to smd 10mil, copper to edge 10mil, drill to drill 10mil, minimum pad ring 10mil, minimum via ring 8mil, stop-mask expansion 0mil, vias tented up to drill 0mil, thermal gap 10mil
Holes 2.8 mm at 141.55,92.79 9.55,92.81 9.55,8.81 141.55,8.79 146.73,98.6
tRestrict: area 7.3,90.6 to 11.8,95

### Footprints (pad centres in the part's own frame; a part is rotated, then mirrored left to right if it is on the bottom)
C4111-15 = drill 1.499 long: A 7.62,0; C -7.62,0
JP2 = drill 0.914 long: 1 -2.54,0; 2 0,0; 3 2.54,0
22-23-2021 = drill 1 long: 1 -1.27,0; 2 1.27,0
E5-10,5 = drill 1.016 pad 2.54: + -2.54,0 | drill 1.016 pad 2.54 octagon: - 2.54,0
E1,8-4 = drill 0.711 pad 1.168: + -0.889,0 | drill 0.711 pad 1.168 octagon: - 0.889,0
C0805K = smd 1.3 x 1.6: 1 -1,0; 2 1,0
0402-1005X55N = smd 0.62 x 0.62: 1 -0.45,0; 2 0.45,0
0603-1608X90N = smd 0.95 x 1: 1 -0.8,0; 2 0.8,0
WCAP-AS5H_10X10.5(DXL) = smd 4.4 x 1.9: 1 4.35,0; 2 -4.35,0
E3,5-8 = drill 0.813 pad 1.6: + -1.778,0 | drill 0.813 pad 1.6 octagon: - 1.778,0
E2-5 = drill 0.813 pad 1.27: + -1.016,0 | drill 0.813 pad 1.27 octagon: - 1.016,0
SOD123F = smd 1.8 x 1.34: A 0,-1.43; C 0,1.43
DO41-10 = drill 1.118: A 5.08,0; C -5.08,0
BD33KA5FPE2 = smd 1.5 x 2.5: 1 -2.3,-4.6; 3 2.3,-4.6 | smd 7 x 7: 2 0,4.4
KTT0003B = smd 2.16 x 1.07: 1 12.67,-2.54; 2 12.67,0; 3 12.67,2.54 | smd 7 x 8.33: 4 2,0 | smd 1.91 x 1.235: 5 -0.545,4.782; 6 -0.545,-4.782
TO254P480X1010X2300-3P = drill 1.23 pad 1.845 square: 1 0,0 | drill 1.23 pad 1.845: 2 2.54,0; 3 5.08,0
TO254P1524X483-4N = smd 3.8 x 1: 1 -6.4,2.54; 2 -6.4,0; 3 -6.4,-2.54 | smd 9 x 10.75: 4 3.8,0
DIL8 = drill 0.8 long: P1 -3.81,2.54; P2 -1.27,2.54; P3 1.27,2.54; P4 3.81,2.54; P5 3.81,8.89; P6 1.27,8.89; P7 -1.27,8.89; P8 -3.81,8.89
1X01 = drill 1.016 pad 1.88: 1 0,0
6410-10 = drill 1.016 long: 1 11.43,0; 2 8.89,0; 3 6.35,0; 4 3.81,0; 5 1.27,0; 6 -1.27,0; 7 -3.81,0; 8 -6.35,0; 9 -8.89,0; 10 -11.43,0
I4-PAC = drill 1.6 pad 2.3: 1 -7.62,0; 2 -3.81,0; 3 3.81,0; 4 7.62,0
SFT1030 = drill 1.118 long: 1 -6.35,0; 2 6.35,0
PE52629NL = drill 1.14 pad 1.74: 1 -5.08,-7.62; 2 5.08,7.62
WE-PD_1280 = smd 2.9 x 5.4: 1 -4.95,0; 2 4.95,0
SRN6045 = smd 3 x 6: 1 -2.85,0; 2 2.85,0
TO263-5 = smd 1.067 x 2.159: 1 -3.404,-5.791; 2 -1.702,-5.791; 3 0,-5.791; 4 1.702,-5.791; 5 3.404,-5.791 | smd 10.8 x 10.41: 6 0,2.54
TO263-3 = smd 1.067 x 2.159: 1 -2.54,-5.791; 2 0,-5.791; 3 2.54,-5.791 | smd 10.8 x 10.41: TAB 0,2.54
TO220V = drill 1.016 long: 1 -2.54,-2.54; 2 0,-2.54; 3 2.54,-2.54
DIL14 = drill 0.813 long: 1 -7.62,-3.81; 2 -5.08,-3.81; 3 -2.54,-3.81; 4 0,-3.81; 5 2.54,-3.81; 6 5.08,-3.81; 7 7.62,-3.81; 8 7.62,3.81; 9 5.08,3.81; 10 2.54,3.81; 11 0,3.81; 12 -2.54,3.81; 13 -5.08,3.81; 14 -7.62,3.81
0207/10 = drill 0.813 octagon: 1 -5.08,0; 2 5.08,0
M0805 = smd 1.3 x 1.6: 1 -0.95,0; 2 0.95,0
R0805 = smd 1.3 x 1.5: 1 -0.95,0; 2 0.95,0
0805-THM = drill 0.813 pad 1.676 octagon: 1 -5.08,0; 2 5.08,0
22-23-2031 = drill 1 long: 1 -2.54,0; 2 0,0; 3 2.54,0
MA20-2 = drill 1.016 octagon: 1 -24.13,-1.27; 2 -24.13,1.27; 3 -21.59,-1.27; 4 -21.59,1.27; 5 -19.05,-1.27; 6 -19.05,1.27; 7 -16.51,-1.27; 8 -16.51,1.27; 9 -13.97,-1.27; 10 -13.97,1.27; 11 -11.43,-1.27; 12 -11.43,1.27; 13 -8.89,-1.27; 14 -8.89,1.27; 15 -6.35,-1.27; 16 -6.35,1.27; 17 -3.81,-1.27; 18 -3.81,1.27; 19 -1.27,-1.27; 20 -1.27,1.27; 21 1.27,-1.27; 22 1.27,1.27; 23 3.81,-1.27; 24 3.81,1.27; 25 6.35,-1.27; 26 6.35,1.27; 27 8.89,-1.27; 28 8.89,1.27; 29 11.43,-1.27; 30 11.43,1.27; 31 13.97,-1.27; 32 13.97,1.27; 33 16.51,-1.27; 34 16.51,1.27; 35 19.05,-1.27; 36 19.05,1.27; 37 21.59,-1.27; 38 21.59,1.27; 39 24.13,-1.27; 40 24.13,1.27
MA04-2 = drill 1.016 octagon: 1 -3.81,-1.27; 2 -3.81,1.27; 3 -1.27,-1.27; 4 -1.27,1.27; 5 1.27,-1.27; 6 1.27,1.27; 7 3.81,-1.27; 8 3.81,1.27
22-23-2041 = drill 1 long: 1 -3.81,0; 2 -1.27,0; 3 1.27,0; 4 3.81,0
TO126V = drill 1.016 long: 1 -2.286,-1.27; 2 0,-1.27; 3 2.286,-1.27
VREG_TPS79625KTTR = smd 3.4 x 1: 1 -10.6,3.4; 2 -10.6,1.7; 3 -10.6,0; 4 -10.6,-1.7; 5 -10.6,-3.4 | smd 8.6 x 10.7: 6 0,0
SO08 = smd 0.6 x 2.2: 1 -1.905,-2.6; 2 -0.635,-2.6; 3 0.635,-2.6; 4 1.905,-2.6; 5 1.905,2.6; 6 0.635,2.6; 7 -0.635,2.6; 8 -1.905,2.6
22-23-2061 = drill 1 long: 1 -6.35,0; 2 -3.81,0; 3 -1.27,0; 4 1.27,0; 5 3.81,0; 6 6.35,0

### Placement (x,y rotation side)
1N5820  19.19,26.54 90 top
5V_VDD4_10V  71.88,30.73 270 top
5V_VDD5_10V  76.71,30.73 270 top
10V_VDD6_5V  61.72,12.45 0 top
10V_VDD_5V  11.94,64.26 0 top
BATTERY  21.4,5.53 0 top
C1  69.86,94.49 90 top
C2  58.86,94.28 90 top
C3  31.98,93 90 top
C4  43.32,92.84 90 top
C5  51.57,85.45 90 top
C6  62.49,82.58 90 top
C7  32.59,79.71 90 top
C8  43.76,77.27 90 top
C9  55.36,70.81 90 top
C10  68.71,70.42 90 top
C11  33.06,67.25 90 top
C12  44.62,64.56 90 top
C15  64.01,31.24 90 top
C16  16.76,39.12 270 top
C17  9.14,49.28 90 top
C18  9.14,43.18 0 top
C19  21.59,48.01 0 top
C20  11.94,43.18 180 top
C21  20.83,42.93 0 top
C22  15.75,42.93 180 top
C23  71.99,24.02 90 top
C24  20.07,-8.38 0 top  (outside the outline)
C25  49.87,32.89 90 top
C26  13.88,34.31 90 top
C27  56.12,28.7 90 top
C28  58.78,32.73 90 top
C29  47.24,-13.46 0 top  (outside the outline)
CS1  6.73,34.5 90 top
CS2  16.56,13.06 90 top
D1  12.45,51.56 0 top
D2  81.94,97.94 0 top
D3  81.99,93.27 0 top
D4  81.94,89.05 0 top
D5  81.21,85.24 0 top
D6  80.67,82.7 180 bottom
D7  83.84,80.16 0 top
D8  80.03,77.62 0 top
D9  83.84,75.08 0 top
D10  80.03,72.54 0 top
D11  83.84,70 0 top
D12  80.03,67.46 0 top
D13  83.84,64.92 0 top
D16  31.75,-47.24 180 top  (outside the outline)
IC1  -5.84,18.03 180 top  (outside the outline)
IC2  8.13,28.45 270 bottom
IC3  -28.19,-55.63 0 top  (outside the outline)
IC4  46.74,20.07 90 top
IC5  57.19,22.06 270 top
J1  24.13,42.16 0 top
J2  112.52,5.59 180 top
J3  86.36,5.59 180 top
K1  110.24,95.76 0 top
K2  104.9,90.42 0 top
K3  98.04,85.09 0 top
K4  103.89,79.76 0 top
K5  104.65,73.66 0 top
K6  106.93,67.82 0 top
L1  34.42,33.49 0 top
L2  35.81,38.61 90 top
L3  40.13,42.42 180 top
L4  20.32,52.58 0 top
L5  -7.11,-9.65 0 top  (outside the outline)
LM2575S  32.67,20.19 0 bottom
LM2937  47.9,19.83 0 bottom
LM2940T  8.23,15.77 180 top
LMC1  60.96,46.23 0 top
LMC6484  116.31,23.95 0 top
R1  19.9,97.47 180 top
R2  19.84,94.93 0 bottom
R3  19.84,92.39 0 bottom
R4  19.84,89.85 0 bottom
R5  19.84,87.31 0 bottom
R6  19.93,84.74 0 bottom
R7  19.93,82.2 0 bottom
R8  19.93,79.66 0 bottom
R9  9.85,76.17 0 bottom
R10  9.85,73.63 0 bottom
R11  9.85,71.09 0 bottom
R12  9.85,68.55 0 bottom
R15  124.46,96.27 0 top
R16  116.84,90.68 0 top
R17  109.98,85.34 0 top
R18  116.08,80.26 0 top
R19  117.6,74.93 0 top
R20  112.01,63.25 0 top
R21  10.41,45.47 90 top
R22  9.14,46.74 270 top
R23  62.91,25.87 0 bottom
R24  139.04,88.34 0 top
R25  133.86,88.44 0 top
R26  133.86,85.98 0 top
R27  20.57,45.47 90 top
R28  22.61,44.96 180 top
R29  133.86,83.57 0 top
R30  133.86,81.15 0 top
R31  133.86,78.74 0 top
R32  133.86,76.22 0 top
R33  133.86,73.66 0 top
R34  133.86,71.25 0 top
R35  133.86,68.83 0 top
R36  133.86,66.29 0 top
R37  133.86,63.88 0 top
R40  18.29,42.93 180 top
R41  26.67,-37.34 0 top  (outside the outline)
R42  6.1,-44.96 0 top  (outside the outline)
R58  10.99,68.55 0 top
R59  10.99,71.09 0 top
R60  10.99,73.63 0 top
R61  10.99,76.17 0 top
R62  19.8,79.41 0 top
R63  9.3,39.9 180 top
R64  19.8,81.94 0 top
R65  19.8,84.48 0 top
R66  19.72,87.06 0 top
R67  19.72,89.6 0 top
R68  19.72,94.68 0 top
R69  19.72,92.14 180 top
R70  19.72,97.22 180 top
R71  13.98,39.21 270 top
R72  23.69,36.06 270 top
R73  23.69,31.5 270 top
RF1  109.83,17.6 180 bottom
RF2  122.46,17.44 0 bottom
RF3  106.4,29.54 270 bottom
RF4  125.96,27.25 270 bottom
RF5  54.61,39.62 180 bottom
RF6  67.56,39.62 0 bottom
RF7  54.61,53.85 180 bottom
RF8  67.31,53.34 0 bottom
RI1  105.8,19.37 270 bottom
RI2  126.95,21.1 270 bottom
RI3  109.96,30.81 0 bottom
RI4  129.15,28.32 0 bottom
RI5  50.8,42.16 270 bottom
RI6  71.12,41.4 90 bottom
RI7  51.05,52.32 90 bottom
RI8  71.12,51.05 90 bottom
SENS5  82.04,53.85 90 top
SENS6  81.79,44.2 90 top
SENS7  81.79,33.78 90 top
SENS8  81.79,25.4 90 top
SV1  141.63,57.94 270 top
SV2  81.94,89.05 270 top
SV5  51.42,5.76 180 top
SV6  27.86,5.53 0 top
SV7  33.89,5.53 0 top
SV8  39.89,5.5 0 top
SV9  131.01,5.51 0 top
SV10  81.97,78.87 270 top
SV11  81.94,68.66 270 top
T1  133.55,98.12 0 top
T2  131.26,93.68 0 top
T3  122.86,93.35 0 top
T4  124.37,86.64 0 top
T5  124.86,81.45 0 top
T6  125.88,76.3 0 top
T7  121.05,71.27 0 top
T8  108.61,60.73 0 top
T9  99.21,63.02 0 top
T10  104.29,55.52 0 top
T11  94.91,57.05 0 top
T12  95.4,51.59 0 top
U1  27.18,-25.65 0 top  (outside the outline)
U2  15.49,46.74 270 top
UART  65.28,5.69 180 top

### Tracks (layer width: path | path; a pad name or v marks a point on that pad's centre or on a via)
3.3V  (via drill 0.38, 0.5, 0.7 pad 1.27)  (3 unrouted)
  Top 0.61: v136.38,57.81 136.35,57.83 134.81,57.83
  Top 0.813: R26.2 R29.2 R30.2 R31.2 R32.2 R33.2 R34.2 R35.2 R36.2 R37.2 | R25.2 R26.2 | R24.2 139.99,85.98 R26.2 | v135.02,36.35 134.87,36.2 134.87,18.54 131.32,14.99 114.3,14.99 108.71,9.4 J2.4 | v93.73,35.05 93.73,37.48 92.18,39.02 72.97,39.02 v68.21,34.27
  Bottom 0.254: v68.21,34.27 68.21,34.29
  Bottom 0.813: SV1.38 SV1.37 v135.02,36.35 | SV8.1 38.62,7.13 45.36,13.87 LM2937.3 | v135.02,36.35 136.38,37.7 v136.38,57.81 | v135.02,36.35 133.02,36.35 130.2,33.53 95.25,33.53 v93.73,35.05 | C28.+ 60.54,31.84 62.99,34.29 68.21,34.29
  Bottom 1.016: LM2937.3 41.31,16.27 41.31,28.79 50.9,28.79 53.95,31.84 C28.+
5V  (4 unrouted)
  Top 0.254: C25.+ 49.77,31.11 | R73.2 arc90 23.71,30.56 arc-90 R73.2
  Top 0.508: C19.1 20.57,47.79 | 22.41,54.1 22.41,53.34 L4.2
  Top 0.61: 20.57,47.79 R27.2 | 22.41,54.1 14.48,62.03 10V_VDD_5V.3 | L4.2 20.79,50.2 C19.1
  Top 0.813: 23.75,30.6 R73.2 | 28.07,30.73 27.94,30.6
  Top 1.016: 27.94,30.6 23.75,30.6 | L1.1 28.07,30.73 | SV7.1 32.62,8.32 33.64,9.34 39.86,9.34 39.86,30.35 | 5V_VDD5_10V.3 5V_VDD4_10V.3 | L1.1 28.19,33.61 L2.2 33.91,43.69 L3.2 | L1.1 32.97,33.49 36.11,30.35 39.86,30.35 | C27.+ 55.46,27.81 52.16,31.11 C25.+ | 39.86,30.35 43.93,30.35 44.69,31.11 49.77,31.11
  Bottom 0.813: 80.01,1.88 32.61,1.88 32.62,1.89 SV7.1 | 80.01,1.88 105.92,1.88 106.17,2.13 J2.3 | 58.79,28.45 58.15,27.81 C27.+ | J3.3 80.01,1.88
  Bottom 1.016: LM2937.1 53.74,14.04 55.45,15.75 55.61,15.75 | 55.61,15.75 55.61,27.55 55.86,27.55 C27.+ | 5V_VDD4_10V.3 71.63,28.45 58.79,28.45 | 10V_VDD6_5V.3 64.26,15.75 55.61,15.75 | L2.2 14.48,57.4 10V_VDD_5V.3 | 105.92,1.88 142.34,1.88 147.32,6.86 147.32,37.34 145.77,38.89 SV1.36 SV1.35
7V  (4 unrouted)
  Top 0.61: 26.59,1.95 26.61,1.93
  Top 0.813: 62.83,22.97 63.18,23.33 | 62.83,30.35 62.83,30.48 | J2.2 103.63,1.93 | J3.2 77.47,1.93
  Top 1.016: 26.61,1.93 55.37,1.93 | 121,1.93 129,1.93 132.23,1.97 SV9.3 | 121,1.93 103.63,1.93 77.47,1.93 55.37,1.93 | SV6.1 26.59,1.95 | 121.36,2.29 121,1.93 | LMC1.4 60.96,38.86 61.82,38.01 61.82,31.5 62.83,30.48 62.83,22.97 62.83,16.86 61.98,16 60.45,16 59.18,14.73 | 5V_VDD5_10V.1 5V_VDD4_10V.1 | 63.18,23.33 IC5.P7 | 10V_VDD6_5V.1 56.39,12.45 56.39,7.87 | 55.37,5.72 55.37,1.93 | C15.+ 62.83,30.35
  Bottom 0.254: IC2.3 5.69,15.88 LM2940T.3
  Bottom 0.813: 86.08,22.61 115.36,22.61 116.31,21.66 LMC6484.4 | 72.18,23.33 C23.+ | C15.+ 67.18,30.35 70.1,33.27 5V_VDD4_10V.1
  Bottom 1.016: SV6.1 26.62,5.56 26.62,7.32 21.9,12.05 CS2.+ 8.4,12.05 5.69,14.76 LM2940T.3 3.05,18.31 3.05,55.63 9.4,61.98 10V_VDD_5V.1 | IC5.P7 72.18,23.33 | C23.+ 76.05,23.13 79.12,20.07 83.54,20.07 86.08,22.61
12V  (1 unrouted)
+12V  (via drill 0.7 pad 1.27)  (3 unrouted)
  Top 0.254: R22.1 9.14,47.37
  Top 0.508: 4.65,47.23 4.64,47.24 | R22.1 9.09,47.24
  Top 0.61: R2.2 R1.2 | 9.14,47.37 U2.2 | 9.09,47.24 4.64,47.24
  Top 0.813: R2.2 14.64,94.93 14.64,92.39 | 14.64,92.39 R3.2 | 14.64,89.85 14.64,92.39 | 14.64,89.85 R4.2 | 14.64,89.85 14.64,87.31 R5.2 14.76,85.12 14.72,84.74 | 14.72,84.74 R6.2 | 14.72,82.2 14.72,84.74 | 14.72,82.2 R7.2 | 14.72,79.66 14.72,81.18 | 14.72,81.18 14.72,82.2 | 14.72,79.66 R8.2 | 14.72,81.18 9.77,81.17 R9.2 4.64,76.17 4.64,73.63 | 4.64,73.63 R10.2 | 4.64,71.09 4.64,73.63 | 4.64,71.09 R11.2 | 4.64,68.55 4.64,71.09 | 4.64,68.55 R12.2 | 4.64,68.55 4.64,66.01 4.64,63.44 4.63,56.44 4.64,56.49 4.64,47.24 | R70.2 R68.1 R69.2 R67.1 R66.1 18.77,84.49 R65.1 R64.1 R62.1 14.97,79.41 14.72,79.66 | 13.35,32.76 14.58,32.76 14.58,18.31 LM2940T.1 | 4.64,46.99 4.64,43.18 | 4.64,43.18 4.64,39.91 | 4.64,39.91 4.64,34.48 5.63,33.49 CS1.+ 6.73,32.76 13.35,32.76 | R63.2 4.64,39.91 | C26.+ 13.35,32.76 | C18.1 4.64,43.18
  Top 1.27: LM2940T.1 12.7,18.31 12.7,9.65 16.82,5.53 BATTERY.1 20.07,5.59 20.07,8.64 23.61,12.19 v36.46,12.19
  Bottom 0.254: LM2940T.1 12.45,16.64 12.45,14.73
  Bottom 0.813: v36.46,12.19 36.38,14.09 LM2575S.1
  pour Top: 18.88,99.76 3,99.76 3,31.6 14.88,31.6 15.14,19.09 12.61,16.56 12.43,2.01 24.17,2.07 24.54,2.44 24.54,11.4 37.47,11.4 37.47,27.94 18.54,28.11 15.48,33.27 11.61,33.27 7.21,37.68 7.21,78.63 18.88,78.63
CTS
  Top 0.254: SV1.24 142.15,54.13 140.88,52.86 138.96,52.86 arc90 138.94,52.83
  Top 0.508: 138.94,52.83 126.24,52.83 103.12,29.72 95.4,29.72 83.82,18.14 75.51,18.14 66.55,9.17 UART.3
EN  (1 unrouted)
GND  (87 unrouted)
  Top 0.406: R21.1 10.41,44.46 | C22.2 15.3,46.54 16.13,47.37 U2.7
  Top 0.508: R28.1 23.06,43.75 23.09,43.73 | U2.7 16.64,47.37 13.88,50.13 D1.A
  Top 0.61: C21.2 22.29,42.93 23.09,43.73 23.09,43.2 J1.1 23.88,41.91 14.28,41.91 | 14.28,41.91 C22.2 | 10.41,44.46 9.94,43.99 C18.2 C20.2 11.49,42.11 11.68,41.91 14.28,41.91 | C19.2 23.06,47.34 R28.1
  Top 0.813: C16.2 16.75,38.26 R71.2
  Top 1.016: 23.64,37.06 R72.1 22.04,37.01 1N5820.A 19.19,35.69 C16.2
  Bottom 0.254: IC2.2 8.23,15.88 LM2940T.2
  Bottom 0.61: LM2575S.5 29.25,12.24 32.67,12.24 LM2575S.3
  pour Bottom: -0.1,101.73 -0.08,-0.05 151.18,-0.03 151.15,101.75
N$1
  Top 0.813: R70.1 23.72,97.22 R1.1 25.14,97.47 26.54,98.88 62.93,98.88 C1.+ D2.C 80.67,94.13 SV2.1
N$2
  Top 0.254: 87.04,97.92 arc90 D2.A arc-90 87.04,97.92 | 87.04,97.92 87.04,97.85 87.04,97.92
  Top 0.813: SV2.2 83.21,94.14 D2.A | 87.04,97.85 88.44,99.25 133.62,99.25 T1.2
N$3
  Top 0.254: R68.2 arc90 20.92,94.93
  Top 0.813: 76.81,92.67 79.4,90.32 SV2.3 | 20.92,94.93 R2.1 25.93,94.93 28.6,97.6 51.84,97.6 57.7,91.75 C2.+ 66.17,91.75 68.02,89.89 74.03,89.89 76.81,92.67 | D3.C 76.91,92.77 76.81,92.67
N$4
  Top 0.406: 77.17,88.73 76.86,88.42 D4.C
  Top 0.813: R69.1 20.92,92.39 R3.1 30.05,92.39 C3.+ 33.87,92.36 52.11,92.36 55.29,89.17 65.98,89.17 67.19,87.96 75.77,87.96 D4.C 77.17,88.73 78.13,87.78 SV2.5
N$5
  Top 0.813: R67.2 20.92,89.85 R4.1 27.99,89.85 29.94,87.9 40.92,87.9 C4.+ 44.31,90.3 48.67,85.93 53.37,85.93 54.61,87.17 65.1,87.17 67.03,85.24 D5.C SV2.7
N$6
  Top 0.813: R66.2 20.92,87.31 R5.1 27.76,87.31 28.82,86.26 44.99,86.26 48.34,82.91 C5.+ 51.78,82.7 D6.C
  Top 1.016: SV10.1 75.61,82.68 D6.C
N$7
  Top 0.813: R65.2 21,84.74 R6.1 43.26,84.74 48,80 62.46,80 C6.+ 78.69,80.03 | 78.79,80.14 D7.C
  Top 1.016: SV10.3 78.79,80.14 78.69,80.03
N$8
  Top 0.813: R64.2 21,82.2 R7.1 27.56,82.2 C7.+ 32.64,77.11 46,77.11 46.51,77.62 D8.C
  Top 1.016: SV10.5 74.98,77.6 D8.C
N$9
  Top 0.813: R62.2 21,79.66 R8.1 26.16,79.66 30.96,74.86 43.63,74.86 C8.+ 47.22,74.73 48.41,75.91 72.69,75.91 73.53,75.08 D9.C
  Top 1.016: SV10.7 78.79,75.06 D9.C
N$10
  Top 0.813: R61.2 R9.1 25.01,76.17 28.78,72.4 51.23,72.4 C9.+ 57.22,68.27 59.32,70.37 71.15,70.37 73.33,72.54 D10.C 74.98,72.52
  Top 1.016: SV11.1 75.03,72.47 74.98,72.52
N$11
  Top 0.813: R60.2 R10.1 24.77,73.63 31.18,67.22 34.26,67.22 37.73,70.69 47.86,70.69 52.85,65.7 59.16,65.7 61.34,67.88 C10.+ 70.82,67.88 72.95,70 D11.C 78.79,69.98
  Top 1.016: SV11.3 78.84,69.93 D11.C
N$12
  Top 0.813: R59.2 R11.1 24.41,71.09 30.79,64.71 C11.+ 33.56,64.2 71.31,64.2 74.57,67.46 D12.C 74.98,67.44
  Top 1.016: SV11.5 75.03,67.39 74.98,67.44
N$13
  Top 0.813: R58.2 R12.1 23.31,68.55 29.84,62.02 C12.+ 74.08,62.02 76.98,64.92 D13.C 78.79,64.9
  Top 1.016: SV11.7 78.84,64.85 78.79,64.9
N$16
  Top 0.813: 5V_VDD4_10V.2 70.06,30.73 67.02,33.77 67.02,34.76 73.91,41.66 SENS6.1
  Bottom 0.813: SENS5.1 79.5,51.31 78.74,50.55 78.74,42.42 79.5,41.66 SENS6.1
N$17
  Bottom 0.508: SENS7.2 81.28,33.78 79.5,35.56 57.91,35.56 57.91,41.91 LMC1.3
N$18
  Bottom 0.813: LMC1.2 55.56,42.1 RF5.2
N$19  (via drill 0.38)
  Top 0.254: 140.33,49.02 SV1.27
  Top 0.508: v128.52,49.02 140.33,49.02
  Bottom 0.508: v128.52,49.02 119.77,40.27 77.84,40.27 72.9,45.21 70.87,45.21 56.13,45.21 LMC1.1
  Bottom 0.813: LMC1.1 53.34,39.94 RF5.1 52.39,39.62 RI5.2
N$20
  Top 0.813: UART.5 61.72,5.94 10V_VDD6_5V.2
N$21
  Top 0.61: SENS8.2 80.01,25.4 78.99,26.42 70.97,26.42 65.53,31.86 65.53,37.34 63.5,39.37 LMC1.5
N$22  (via drill 0.7)
  Top 0.813: R73.1 23.69,33.53 | 23.69,33.53 23.69,34.29 R72.2 | v25.87,33.52 v25.86,33.53 23.69,33.53
  Bottom 0.61: LM2575S.4 30.97,16.38 26.07,16.38
  Bottom 0.813: 26.07,16.38 26.07,33.52 v25.87,33.52
N$23
  Top 0.813: R36.1 132.4,66.29 128.08,61.98 120.63,61.98 110.34,51.69 100.78,51.69 97.19,55.27 T11.3
  Bottom 0.813: SV1.15 130.9,64.29 118.3,51.69 100.78,51.69 97.19,55.27 T11.3
N$24
  Top 0.813: T2.2 131.26,93.42 127.2,97.48 127.2,98.03 102.62,98.06 | SV2.4 84.12,90.32 D3.A 91.86,98.06 102.62,98.06 | K1.1 102.62,98.06 | 102.62,98.06
N$25
  Top 0.813: T3.2 122.9,92.12 122.9,93.43 121.59,94.74 120.14,94.74 118.87,93.47 97.28,93.47 | SV2.6 85.75,87.78 D4.A 91.44,93.47 97.28,93.47 | K2.1 97.28,93.47
N$26
  Top 0.813: SV2.8 D5.A 86.49,85.24 88.88,87.63 90.17,87.63 | 90.17,87.63 120.14,87.63 120.4,87.88 122.53,87.88 124.37,86.04 T4.2 | K3.1 90.17,85.34 90.17,87.63
N$27
  Top 0.813: 96.27,82.7 D6.A | K4.1 96.27,82.7 | T5.2 124.86,80.85 123.01,82.7 96.27,82.7
  Top 1.016: SV10.2 85.72,82.68 D6.A
N$28
  Top 0.813: T6.2 125.42,77.38 97.03,77.38 | 97.03,77.38 93.73,77.38 90.95,80.16 D7.A | K5.1 97.03,77.38
  Top 1.016: SV10.4 88.9,80.14 D7.A
N$29
  Top 0.813: D8.A 89.51,77.62 96.27,70.87 99.31,70.87 | 99.31,70.87 113.28,70.87 115.06,72.64 119.78,72.64 121.05,71.37 T7.2 | K6.1 99.31,70.87
  Top 1.016: SV10.6 85.09,77.6 D8.A
N$30
  Top 0.813: D9.A 98.96,65.05 106.99,65.05 108.61,63.43 T8.2
  Top 1.016: SV10.8 88.9,75.06 D9.A
N$31
  Top 0.813: 85.09,72.52 D10.A 85.62,72.03 90.21,72.03 99.21,63.03 T9.2
  Top 1.016: SV11.2 85.04,72.47 D10.A
N$32
  Top 0.813: D11.A 88.92,69.75 94.76,63.91 94.76,58.92 94.78,58.91 101.32,58.91 104.29,55.94 T10.2
  Top 1.016: SV11.4 88.85,69.93 D11.A
N$33
  Top 0.813: T11.2 94.91,56.79 92.88,58.83 92.88,63.27 88.68,67.46 D12.A 85.09,67.44
  Top 1.016: SV11.6 85.04,67.39 D12.A
N$34
  Top 0.813: T12.2 95.4,52.92 90.2,52.93 90.2,63.64 D13.A 88.9,64.9
  Top 1.016: SV11.8 88.85,64.85 88.9,64.9
N$35
  Bottom 0.813: LMC1.6 66.04,40.2 RF6.2
N$36  (via drill 0.38)
  Top 0.254: SV1.28 141.6,47.75 140.91,47.75 140.88,47.78 138.82,47.78 138.79,47.75
  Top 0.508: v128.27,46.74 129.29,47.75 138.79,47.75
  Bottom 0.508: RI6.2 73.91,42.35 76.89,39.38 120.91,39.38 v128.27,46.74
  Bottom 0.813: RF6.1 68.58,39.69 LMC1.7 68.65,42.35 RI6.2
N$37
  Bottom 0.813: LMC1.13 55.88,53.53 RF7.2
N$38
  Bottom 0.813: RF8.2 66.04,53.02 LMC1.9
N$39
  Bottom 0.61: LMC1.12 58.42,47.5 73.15,47.5 79.5,53.85 SENS5.2
N$40
  Top 0.254: 139.72,59.21 137.92,57.4
  Top 0.508: SV1.19 139.72,59.21 | 137.92,57.4 136.91,56.39 123.7,56.39 114.98,47.67 84.83,47.67 83.22,49.28 73.66,49.28 70.94,51.99 55.3,51.99 LMC1.14
  Bottom 0.813: LMC1.14 53.34,53.53 RF7.1 51.63,53.85 RI7.2
N$44
  Top 0.813: R15.2 125.41,96.08 127.43,94.06 127.43,91 128.34,90.09 131.91,90.09 133.55,91.74 T2.3 133.55,92.34 132.91,91.69 R25.1
  Bottom 0.254: 138.99,78.26 141.63,78.26
  Bottom 0.406: 141.63,78.26 SV1.4
  Bottom 0.813: T2.3 133.55,84.64 138.99,78.26
N$45
  Top 0.813: R16.2 117.79,89.41 124.16,89.41 125.17,90.43 125.17,92.06 T3.3 125.15,91.08 130.13,86.11 132.78,86.11 R26.1
  Bottom 0.813: SV1.5 138.33,76.99 134.01,81.81 127.04,89.89 125.15,89.89 T3.3
N$46  (via drill 0.38)
  Top 0.813: v118.62,85.34 R17.2 | R29.1 128.46,83.57 T4.3
  Bottom 0.254: 141.63,75.72 139.09,75.72
  Bottom 0.406: SV1.6 141.63,75.72
  Bottom 0.813: 139.09,75.72 137.56,75.72 127.91,85.37 T4.3 126.66,83.48 125.98,82.8 119.89,82.8 118.62,84.07 v118.62,85.34
N$47  (via drill 0.38)
  Top 0.813: T5.3 128.15,81.17 R30.1 | v119.63,80.26 R18.2
  Bottom 0.813: SV1.7 136.93,74.45 131.2,80.18 T5.3 127,80.03 127,79.36 125.51,77.87 121.94,77.87 119.63,80.17 v119.63,80.26
N$48
  Top 0.813: R31.1 130.87,78.74 128.81,76.67 128.15,76.67 T6.3 128.17,74.53 127.68,74.04 127.68,73.38 127.03,72.72 122.09,72.72 119.89,74.93 R19.2
  Bottom 0.254: 139.09,73.18 141.63,73.18
  Bottom 0.406: 141.63,73.18 SV1.8
  Bottom 0.813: T6.3 129.69,75.03 131.55,73.18 139.09,73.18
N$49
  Top 0.813: R32.1 132.4,76.22 126.86,70.68 126.64,70.68 124.01,70.67 T7.3 123.09,69.75 123.09,68.32 122.23,67.46 117.91,67.46 113.69,63.25 R20.2
  Bottom 0.813: SV1.9 138.07,71.91 136.17,70 T7.3
N$50
  Top 0.813: R33.1 132.65,73.41 132.14,73.41 124.77,66.03 118.75,66.03 112.17,59.46 T8.3
  Bottom 0.254: 141.63,70.64 139.09,70.64
  Bottom 0.406: SV1.10 141.63,70.64
  Bottom 0.813: 139.09,70.64 136.55,68.1 127.66,68.1 119.02,59.46 T8.3
N$51
  Top 0.813: R34.1 132.65,71.25 126.05,64.64 119.12,64.64 111.63,57.15 105.08,57.15 101.5,60.73 T9.3
  Bottom 0.813: T9.3 101.5,60.73 105.08,57.15 118.43,57.15 128.1,66.83 SV1.13
N$52
  Top 0.813: R35.1 132.65,68.83 127.02,63.2 119.84,63.2 110.89,54.25 T10.3
  Bottom 0.254: 141.63,65.56 138.45,65.56
  Bottom 0.406: SV1.14 141.63,65.56
  Bottom 0.813: T10.3 118.07,54.25 129.38,65.56 138.45,65.56
N$53
  Top 0.61: SENS6.2 76.71,44.2 74.17,46.74 64.01,46.74 63.5,47.24 LMC1.10
N$54
  Top 0.254: SV1.20 141.63,57.94 141.63,56.14 140.88,55.4 139.22,55.4 139.19,55.37
  Top 0.508: 139.19,55.37 124.45,55.37 115.61,46.53 84.71,46.53 82.98,48.26 70.36,48.26 LMC1.8
  Bottom 0.813: LMC1.8 68.58,53.02 RF8.1 69.78,53.34 RI8.2
N$55
  Top 0.813: K1.4 118.36,96.27 R15.1
N$56
  Top 0.813: R16.1 115.64,90.42 K2.4
N$57
  Top 1.016: 5V_VDD5_10V.2 81.28,30.73 SENS7.1 83.57,31.24 85.45,29.35 85.45,25.48 82.83,22.86 SENS8.1
N$58
  Top 0.813: R17.1 105.92,85.34 K3.4
N$61
  Top 0.813: T12.3 111.11,50.32 121.48,60.69 129.21,60.69 132.4,63.88 R37.1
  Bottom 0.254: 141.63,63.02 138.45,63.02
  Bottom 0.406: SV1.16 141.63,63.02
  Bottom 0.813: T12.3 120.29,50.32 132.99,63.02 138.45,63.02
N$63
  Top 0.813: R19.1 112.27,74.93 K5.4
N$64
  Top 0.254: R21.2 10.6,46.1
  Top 0.508: 10.6,46.1 U2.3 | R21.2 10.04,46.29 R22.2
N$65
  Top 0.813: SV5.4 47.61,6.78 51.08,10.25 51.08,16.96 57.45,23.33 IC5.P2
N$66
  Top 0.813: IC5.P3 58.46,20.79 52.69,15.02 SV5.2
N$67
  Top 1.016: L1.2 40.81,33.53 L2.1 47.86,33.53 47.86,42.18 47.62,42.42 L3.1
  Bottom 0.61: LM2575S.2 34.38,16.17 34.58,16.38 39.41,16.38 39.41,16.02 39.48,16.09
  Bottom 1.016: L1.2 40.87,33.39 39.48,33.38 39.48,16.09 39.48,10.91 37.92,9.88 29.49,9.88 28.62,9.83 25.98,12.13 1N5820.C
N$68
  Top 0.254: 141.63,45.24 139.09,45.24
  Top 0.406: SV1.30 141.63,45.24
  Top 0.61: 139.09,45.24 131.12,45.24 128.52,42.64 128.52,32.35 LMC6484.8
  Bottom 0.813: 124.06,28.14 124.12,28.08 RF4.1 | 124.06,28.14 125.01,28.33 RI4.2 | LMC6484.8 124.06,27.89 124.06,28.14
N$69
  Top 0.813: K6.4 111.06,64.33 R20.1
N$70
  Top 0.813: R18.1 111.76,80.26 111.51,80.01 K4.4
N$71
  Bottom 0.813: IC5.P1 R23.2
N$72
  Top 0.406: 9.33,48.64 C17.1
  Top 0.61: U2.1 9.33,48.64
N$73
  Top 0.508: 16.76,52.99 L4.1 18.09,51.95
  Top 0.61: C17.2 9.14,52.24 9.9,52.99 D1.C 16.76,52.99 | 18.09,51.95 U2.8
N$74
  Bottom 0.813: R23.1 IC5.P8
N$75  (via drill 0.7, 0.7 pad 1.27)
  Top 0.254: 141.63,42.7 139.09,42.7
  Top 0.406: 141.63,42.7 SV1.32
  Top 0.61: 139.09,42.7 132.87,42.7 130.21,40.04 v130.21,39.01
  Top 0.813: IC5.P6 83.04,20.79 98.16,35.91 v104.56,35.91
  Bottom 0.61: v130.21,39.01 127.12,35.92 104.57,35.92 v104.56,35.91
N$76
  Top 0.508: 20.66,44.96 R27.1 20.39,44.83
  Top 0.61: 20.66,44.96 R28.2 | 20.39,44.83 U2.5
N$77
  Top 0.406: U2.4 12.39,44.33 C20.1
N$79
  Bottom 0.813: RF1.2 110.91,17.6 111.23,18.93 LMC6484.2
N$80  (1 unrouted)
  Top 1.016: R58.1 R59.1 R60.1 R61.1
N$81
  Top 0.61: LMC6484.1 108.69,20.9 111.94,24.15 127.53,24.15 132.08,28.7 132.08,39.62 133.88,41.43 SV1.33
  Bottom 0.813: RF1.1 108.69,17.6 LMC6484.1 107.64,19.09 RI1.2
N$82  (via drill 0.38, 0.7 pad 1.27)
  Top 0.508: v73.15,36.83 77.22,36.83 78.23,37.84 v91.69,37.84
  Top 0.61: SV1.31 131.72,43.97 v130.96,43.2
  Top 0.813: R71.1 16.71,40.16 C16.1 25.68,40.12 26.42,40.85 26.42,48.45 28.01,50.04 46.99,50.04 50.55,46.48 50.55,39.96 53.68,36.83 v59.18,36.83
  Top 1.016: R71.1 11.81,40.16 10.82,39.85 10.31,39.85 R63.1
  Bottom 0.508: v59.18,36.83 v73.15,36.83 | 125.84,38.08 91.94,38.08 v91.69,37.84
  Bottom 0.61: v130.96,43.2 125.84,38.08
N$84
  Bottom 0.813: RF2.2 121.39,19.38 LMC6484.6
N$85
  Top 0.254: 141.63,40.16 138.96,40.16
  Top 0.406: 141.63,40.16 SV1.34
  Top 0.61: LMC6484.7 125.45,20.14 133.33,28.01 133.35,38.35 135.15,40.16 138.96,40.16
  Bottom 0.813: RF2.1 123.93,17.97 LMC6484.7 RI2.2
N$87
  Bottom 0.813: RF3.2 106.38,26.72 107.8,25.6 109.83,25.6 111.23,26.49 LMC6484.13
N$88
  Top 0.508: U2.6 16.2,46.1 C22.1 R40.2
N$89
  Top 0.508: 130.16,46.51 128.94,45.28 125.2,45.28 108.69,28.77 LMC6484.14
  Top 0.61: SV1.29 130.16,46.51
  Bottom 0.813: RI3.2 108.9,28.86 LMC6484.14 108.69,30.55 108.82,30.68 RF3.1
N$90
  Bottom 0.813: LMC6484.9 121.52,25.6 125.07,25.6 RF4.2
N$91
  Top 0.508: C21.1 R40.1
N$93  (2 unrouted)
N$94  (2 unrouted)
RDY  (1 unrouted)
RTS
  Top 0.508: SV1.23 125.5,54.13 102.62,31.24 95.15,31.24 83.31,19.41 74.24,19.41 64.01,9.17 UART.4
RXUC
  Top 0.254: SV1.26 142.15,51.59 140.88,50.32 138.96,50.32 arc90 138.95,50.3
  Top 0.508: 138.95,50.3 127.92,50.3 104.47,26.85 96.34,26.85 88.09,18.59 84.58,15.09 81.03,15.09 UART.1
  Top 0.813: 88.09,18.59 90.17,16.51 J3.7
S1
  Top 0.813: R24.1 138.09,94.6 T1.3
  Bottom 0.813: SV1.3 137.92,81.97 137.92,94.77 T1.3
SCL1
  Top 0.61: SV1.1 142.64,84.35 145.69,84.35 148.74,81.31 148.74,29.46 148.75,3.33 136.51,3.34 136.51,8.44 136,8.44 129.72,8.42 SV9.2
SCL2  (1 unrouted)
  Top 0.254: SV1.11 141.63,70.64 145.18,70.64
  Top 0.61: 145.18,70.64 146.71,69.11 146.71,11.97 116.54,11.96 113.79,9.22 J2.6
SDA1
  Top 0.61: SV1.2 142.9,82.32 144.68,82.32 147.72,79.27 147.72,30.5 147.74,5.03 147.74,5 138,5 138,9.6 137.46,9.6 127.21,9.62 SV9.1
SDA2  (1 unrouted)
  Top 0.61: 144.42,69.37 145.72,68.07 145.72,13.22 115.75,13.21 111.25,8.71 J2.5
  Top 0.813: SV1.12 144.42,69.37
SENS0
  Bottom 0.61: J2.7 116.33,14.48 113.77,17.04 LMC6484.3
SENS1
  Bottom 0.406: J2.8 118.87,12.51 117.6,13.78 117.6,22.65 113.77,26.49 LMC6484.12
SENS2
  Bottom 0.61: LMC6484.5 118.85,13.79 121.38,11.26 121.38,10.7 121.41,10.66 J2.9
SENS3
  Bottom 0.61: J2.10 123.95,9.9 124.05,10
  Bottom 0.813: LMC6484.10 118.85,24.96 119.95,23.86 129.57,23.86 129.57,16.81 124.05,10
TXUC  (1 unrouted)
  Top 0.508: SV1.25 127.28,51.59 103.89,28.19 95.66,28.19 84.07,16.61 76.53,16.61 69.09,9.17 UART.2

### Text on the board
tPlace: 1 | Power Control Board V9 | Wireless sensor network project | Linköping University | 30 | 3.3V | 12V | 10V | 5V | RTS | CTS | TX | RX | SDA3 | SCL3 | SDA2 | SCL2 | SDA1 | SCL1 | GND | GND | GND | Pressure sens | Sens 4 | 12V | GND | Sens 1 | Sens 2 | Sens 3 | I2C3 port | I2C2 port | I2C1 port | 10V | 5V | 3.3V
tNames: C4 | C4 | 10 | 11 | 20 | 21 | 31 | 37
tValues: 1000uF | 1000uF | 1N4004 | 1N4004 | 10uF | 470uF | 10uF | 0.1uF | 0.1uF
bValues: LM2575S | LM2575S